# EAGLE design Generator_V0.9 (EAGLE 5.09)

## Sheet 1 of 5
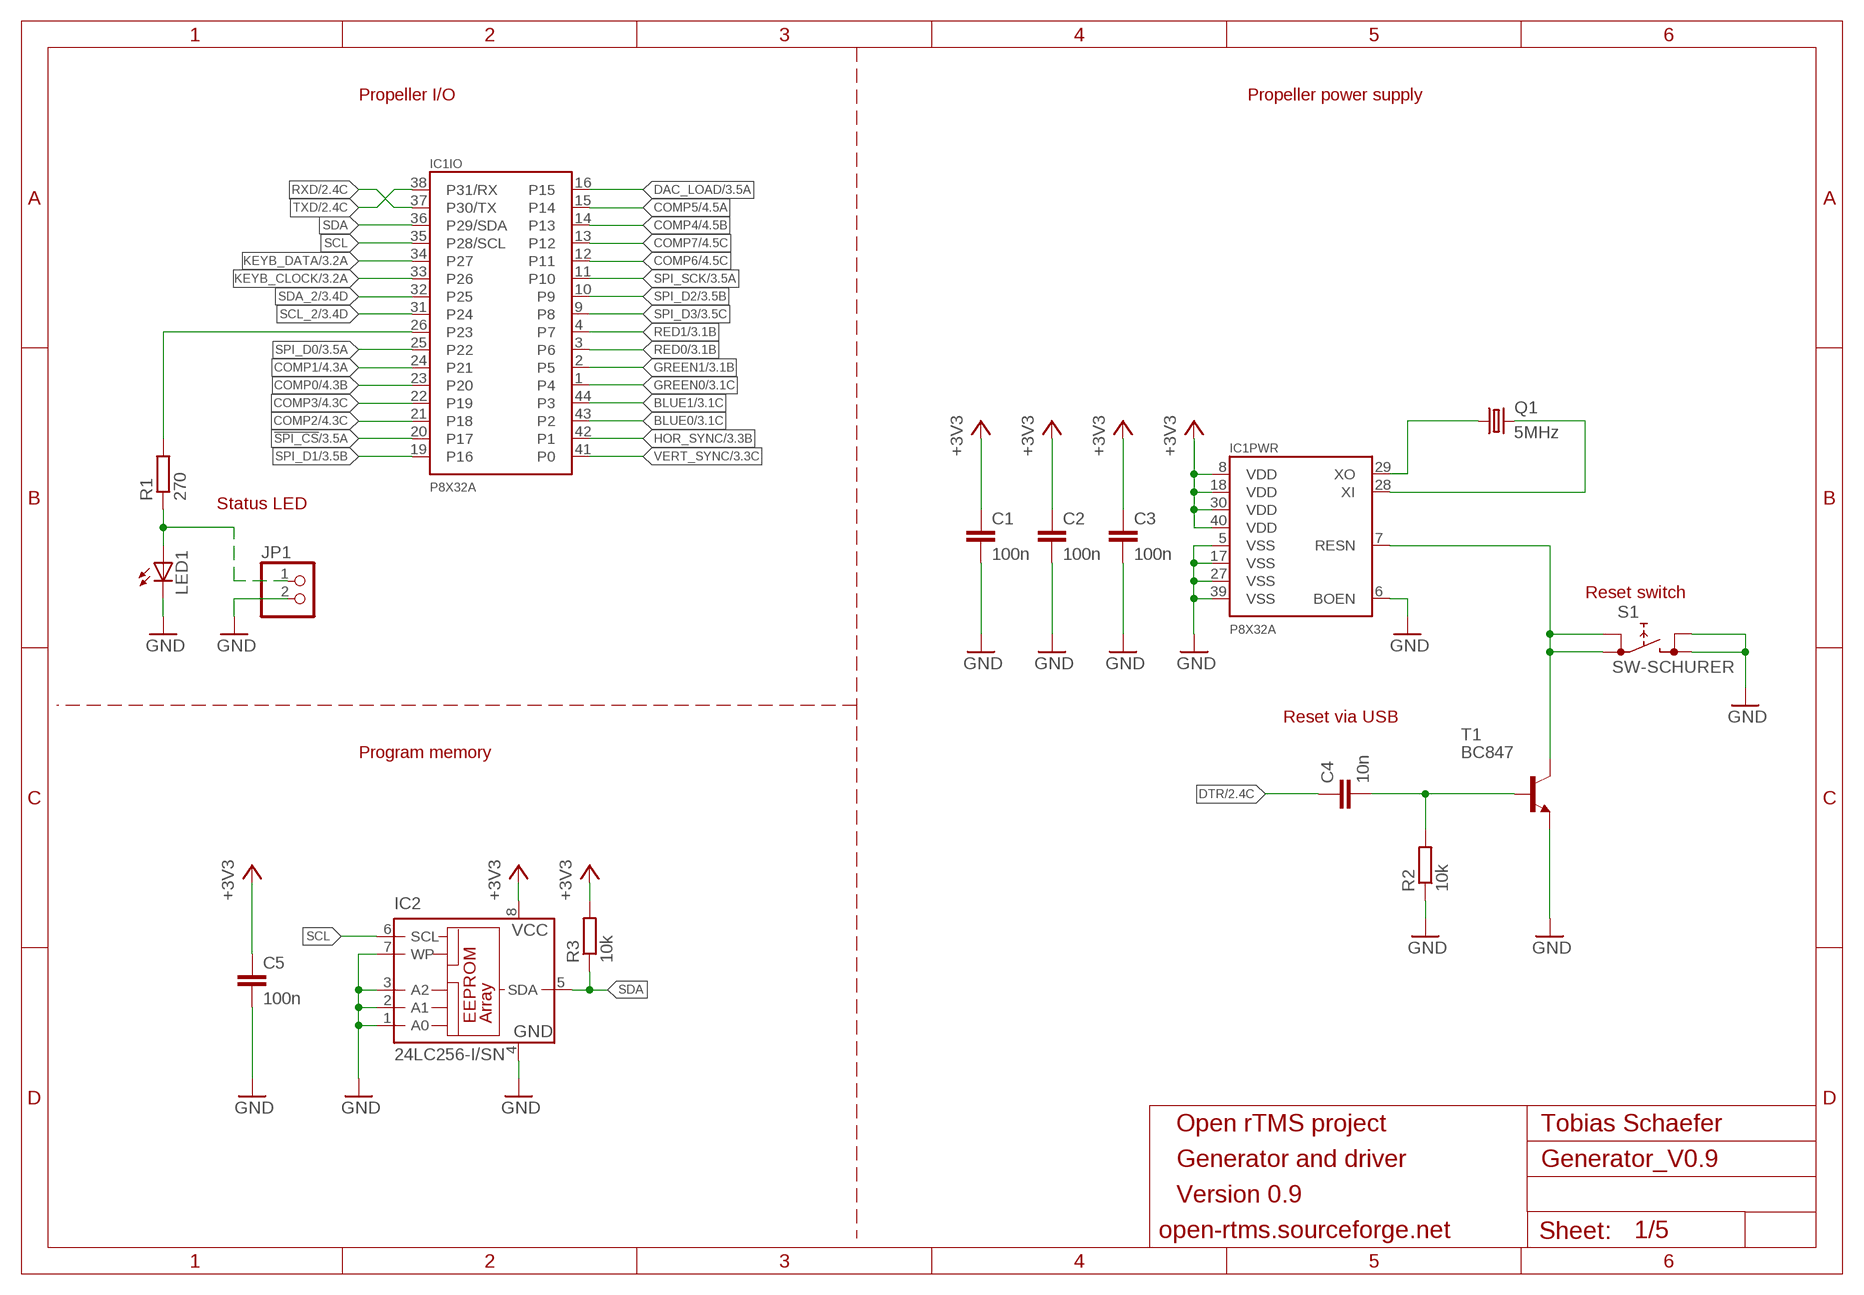
[diagram p0: schematic, sheet 1]

### Parts
C1  100n  C-EUC0603  [C0603]
C2  100n  C-EUC0603  [C0603]
C3  100n  C-EUC0603  [C0603]
C4  10n  C-EUC0603  [C0603]
C5  100n  C-EUC0603  [C0603]
IC1  P8X32A  [VQ44]
IC2  24LC256-I/SN  24C02SN  [SO-08]
JP1  PINHD-1X2  [1X02]
LED1  LEDCHIPLED_0603  [CHIPLED_0603]
Q1  5MHz  CRYSTALCTS406  [CTS406]
R1  270  R-EU_R0603  [R0603]
R2  10k  R-EU_R0603  [R0603]
R3  10k  R-EU_R0603  [R0603]
S1  SW-SCHURER  [SW-SCHUERTER]
T1  BC847  [SOT23]

### Nets
!SPI_CS!: IC1.20(IO:P17) ; also sheet 3
+3V3: C1.1 C2.1 C3.1 C5.1 IC1.8(PWR:VDD) IC1.18(PWR:VDD) IC1.30(PWR:VDD) IC1.40(PWR:VDD) IC2.8(VCC) R3.2 ; also sheet 2,3,4
BLUE0: IC1.43(IO:P2) ; also sheet 3
BLUE1: IC1.44(IO:P3) ; also sheet 3
COMP0: IC1.23(IO:P20) ; also sheet 4
COMP1: IC1.24(IO:P21) ; also sheet 4
COMP2: IC1.21(IO:P18) ; also sheet 4
COMP3: IC1.22(IO:P19) ; also sheet 4
COMP4: IC1.14(IO:P13) ; also sheet 4
COMP5: IC1.15(IO:P14) ; also sheet 4
COMP6: IC1.12(IO:P11) ; also sheet 4
COMP7: IC1.13(IO:P12) ; also sheet 4
DAC_LOAD: IC1.16(IO:P15) ; also sheet 3
DTR: C4.1 ; also sheet 2
GND: C1.2 C2.2 C3.2 C5.2 IC1.5(PWR:VSS) IC1.6(PWR:BOEN) IC1.17(PWR:VSS) IC1.27(PWR:VSS) IC1.39(PWR:VSS) IC2.1(A0) IC2.2(A1) IC2.3(A2) IC2.4(GND) IC2.7(WP) JP1.2 LED1.C R2.1 S1.P$2 S1.P$4 T1.2(E) ; also sheet 2,3,4
GREEN0: IC1.1(IO:P4) ; also sheet 3
GREEN1: IC1.2(IO:P5) ; also sheet 3
HOR_SYNC: IC1.42(IO:P1) ; also sheet 3
KEYB_CLOCK: IC1.33(IO:P26) ; also sheet 3
KEYB_DATA: IC1.34(IO:P27) ; also sheet 3
N$1: IC1.28(PWR:XI) Q1.3
N$2: IC1.29(PWR:XO) Q1.1
N$3: C4.2 R2.2 T1.1(B)
N$4: IC1.7(PWR:RESN) S1.P$1 S1.P$3 T1.3(C)
N$36: IC1.26(IO:P23) R1.2
N$37: JP1.1 LED1.A R1.1
RED0: IC1.3(IO:P6) ; also sheet 3
RED1: IC1.4(IO:P7) ; also sheet 3
RXD: IC1.37(IO:P30/TX) ; also sheet 2
SCL: IC1.35(IO:P28/SCL) IC2.6(SCL)
SCL_2: IC1.31(IO:P24) ; also sheet 3
SDA: IC1.36(IO:P29/SDA) IC2.5(SDA) R3.1
SDA_2: IC1.32(IO:P25) ; also sheet 3
SPI_D0: IC1.25(IO:P22) ; also sheet 3
SPI_D1: IC1.19(IO:P16) ; also sheet 3
SPI_D2: IC1.10(IO:P9) ; also sheet 3
SPI_D3: IC1.9(IO:P8) ; also sheet 3
SPI_SCK: IC1.11(IO:P10) ; also sheet 3
TXD: IC1.38(IO:P31/RX) ; also sheet 2
VERT_SYNC: IC1.41(IO:P0) ; also sheet 3

### Notes on the sheet
- Propeller I/O | Propeller power supply
- Status LED
- Reset switch
- Reset via USB
- Program memory
- Open rTMS project | Tobias Schaefer
- Generator and driver
- Version 0.9
- open-rtms.sourceforge.net

## Sheet 2 of 5
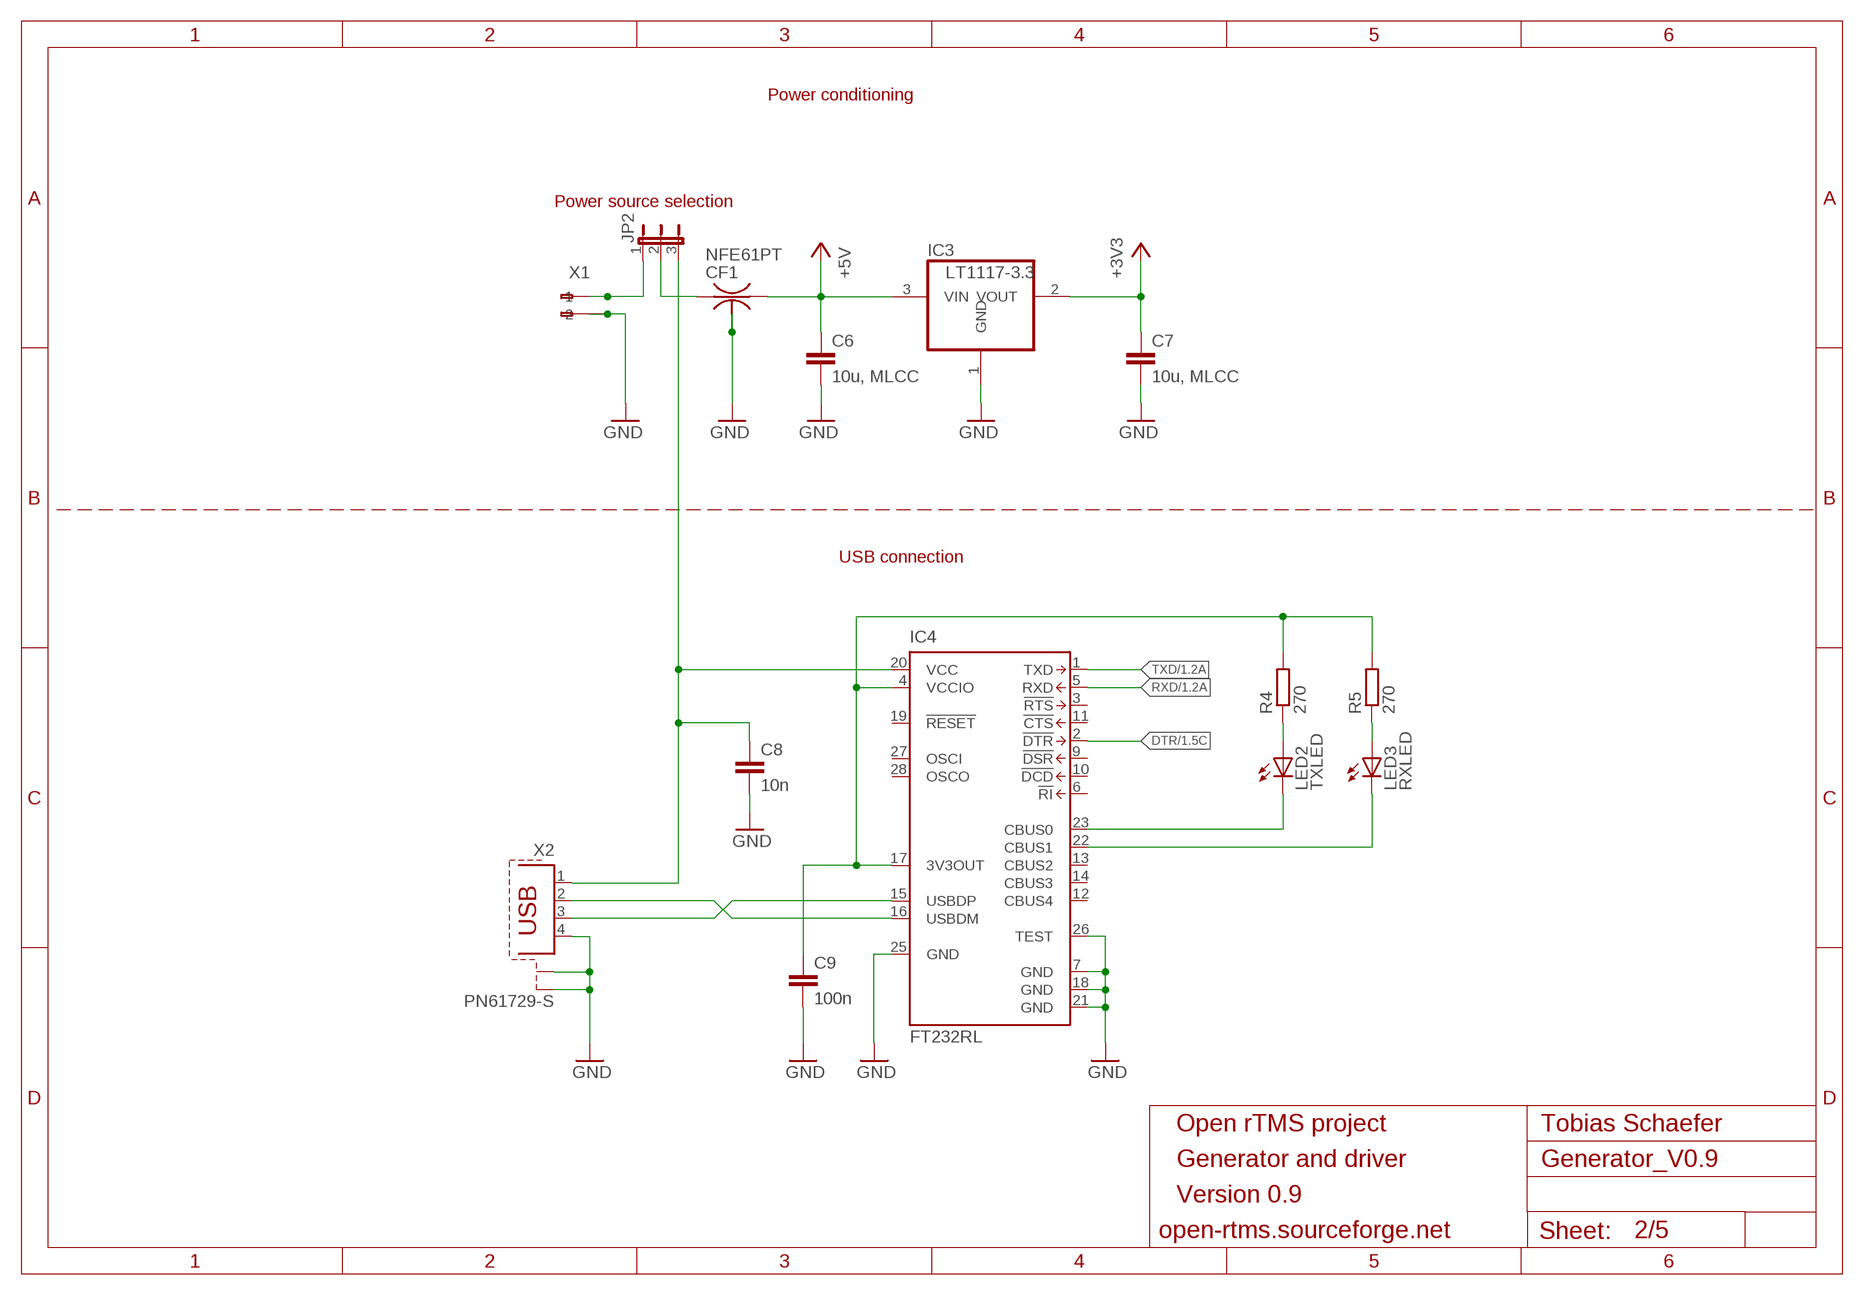
[diagram p1: schematic, sheet 2]

### Parts
C6  10u, MLCC  C-EUC0805  [C0805]
C7  10u, MLCC  C-EUC0805  [C0805]
C8  10n  C-EUC0603  [C0603]
C9  100n  C-EUC0603  [C0603]
CF1  NFE61PT  [NFE61PT]
IC3  LT1117-3.3  REG1117  [SOT223]
IC4  FT232RL  [SSOP28]
JP2  JP2E  [JP2]
LED2  TXLED  LEDCHIPLED_0603  [CHIPLED_0603]
LED3  RXLED  LEDCHIPLED_0603  [CHIPLED_0603]
R4  270  R-EU_R0603  [R0603]
R5  270  R-EU_R0603  [R0603]
X1  233-102  [233-102]
X2  PN61729-S  [PN61729-S]

### Nets
+3V3: C7.1 IC3.2(VOUT) ; also sheet 1,3,4
+5V: C6.1 CF1.3 IC3.3(VIN) ; also sheet 3,4
DTR: IC4.2(!DTR) ; also sheet 1
GND: C6.2 C7.2 C8.2 C9.2 CF1.2@1 CF1.2@2 IC3.1(GND) IC4.7(GND) IC4.18(GND) IC4.21(GND) IC4.25(GND) IC4.26(TEST) X1.A2(-2) X1.B2(B-2) X2.4 X2.S1 X2.S2 ; also sheet 1,3,4
N$5: C9.1 IC4.4(VCCIO) IC4.17(3V3OUT) R4.2 R5.2
N$6: IC4.16(USBDM) X2.2
N$7: IC4.15(USBDP) X2.3
N$8: C8.1 IC4.20(VCC) JP2.3 X2.1
N$12: CF1.1 JP2.2
N$18: LED2.A R4.1
N$19: LED3.A R5.1
N$20: IC4.23(CBUS0) LED2.C
N$21: IC4.22(CBUS1) LED3.C
N$35: JP2.1 X1.A1(-1) X1.B1(B-1)
RXD: IC4.5(RXD) ; also sheet 1
TXD: IC4.1(TXD) ; also sheet 1
Unconnected: IC4.3(!RTS) IC4.6(!RI) IC4.9(!DSR) IC4.10(!DCD) IC4.11(!CTS) IC4.12(CBUS4) IC4.13(CBUS2) IC4.14(CBUS3) IC4.19(!RESET) IC4.27(OSCI) IC4.28(OSCO)

### Notes on the sheet
- Power conditioning
- Power source selection
- USB connection
- Open rTMS project | Tobias Schaefer
- Generator and driver
- Version 0.9
- open-rtms.sourceforge.net

## Sheet 3 of 5
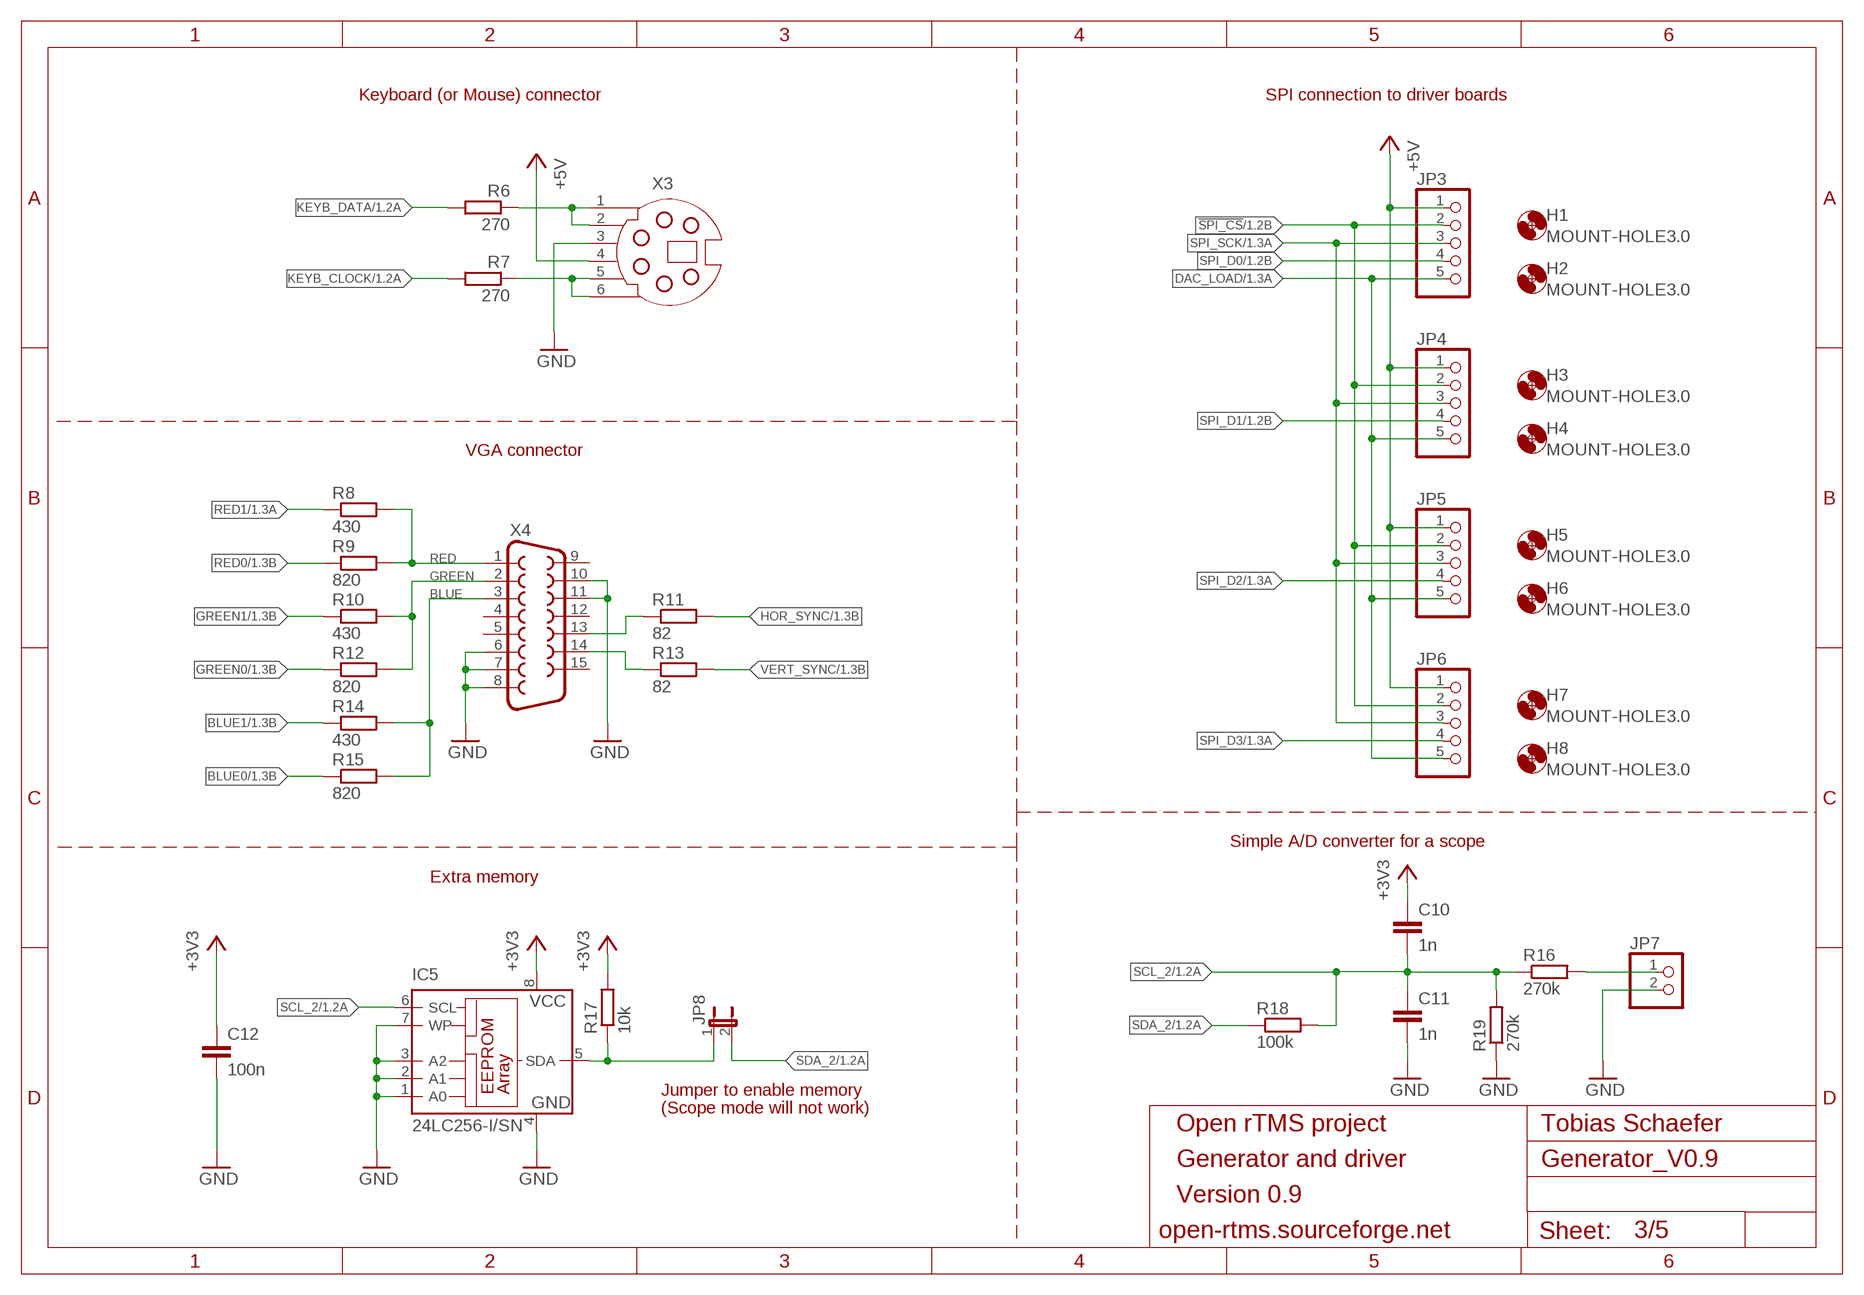
[diagram p2: schematic, sheet 3]

### Parts
C10  1n  C-EUC0603  [C0603]
C11  1n  C-EUC0603  [C0603]
C12  100n  C-EUC0603  [C0603]
H1  MOUNT-HOLE3.0  [3,0]
H2  MOUNT-HOLE3.0  [3,0]
H3  MOUNT-HOLE3.0  [3,0]
H4  MOUNT-HOLE3.0  [3,0]
H5  MOUNT-HOLE3.0  [3,0]
H6  MOUNT-HOLE3.0  [3,0]
H7  MOUNT-HOLE3.0  [3,0]
H8  MOUNT-HOLE3.0  [3,0]
IC5  24LC256-I/SN  24C02SN  [SO-08]
JP3  PINHD-1X5  [1X05]
JP4  PINHD-1X5  [1X05]
JP5  PINHD-1X5  [1X05]
JP6  PINHD-1X5  [1X05]
JP7  PINHD-1X2  [1X02]
JP8  JP1E  [JP1]
R6  270  R-EU_R0603  [R0603]
R7  270  R-EU_R0603  [R0603]
R8  430  R-EU_R0603  [R0603]
R9  820  R-EU_R0603  [R0603]
R10  430  R-EU_R0603  [R0603]
R11  82  R-EU_R0603  [R0603]
R12  820  R-EU_R0603  [R0603]
R13  82  R-EU_R0603  [R0603]
R14  430  R-EU_R0603  [R0603]
R15  820  R-EU_R0603  [R0603]
R16  270k  R-EU_R0603  [R0603]
R17  10k  R-EU_R0603  [R0603]
R18  100k  R-EU_R0603  [R0603]
R19  270k  R-EU_R0603  [R0603]
X3  MDSSV-BC06  [SSV-BC06]
X4  F15HDH  [HDF15H]

### Nets
!SPI_CS!: JP3.2 JP4.2 JP5.2 JP6.2 ; also sheet 1
+3V3: C10.1 C12.1 IC5.8(VCC) R17.2 ; also sheet 1,2,4
+5V: JP3.1 JP4.1 JP5.1 JP6.1 X3.4 ; also sheet 2,4
BLUE: R14.2 R15.2 X4.3
BLUE0: R15.1 ; also sheet 1
BLUE1: R14.1 ; also sheet 1
DAC_LOAD: JP3.5 JP4.5 JP5.5 JP6.5 ; also sheet 1
GND: C11.2 C12.2 IC5.1(A0) IC5.2(A1) IC5.3(A2) IC5.4(GND) IC5.7(WP) JP7.2 R19.1 X3.3 X4.6 X4.7 X4.8 X4.10 X4.11 ; also sheet 1,2,4
GREEN: R10.2 R12.2 X4.2
GREEN0: R12.1 ; also sheet 1
GREEN1: R10.1 ; also sheet 1
HOR_SYNC: R11.2 ; also sheet 1
HSYNC: R11.1 X4.13
KEYB_CLOCK: R7.2 ; also sheet 1
KEYB_DATA: R6.2 ; also sheet 1
N$40: R6.1 X3.1 X3.2
N$42: IC5.5(SDA) JP8.1 R17.1
N$43: JP7.1 R16.2
N$65: R7.1 X3.5 X3.6
RED: R8.2 R9.2 X4.1
RED0: R9.1 ; also sheet 1
RED1: R8.1 ; also sheet 1
SCL_2: C10.2 C11.1 IC5.6(SCL) R16.1 R18.2 R19.2 ; also sheet 1
SDA_2: JP8.2 R18.1 ; also sheet 1
SPI_D0: JP3.4 ; also sheet 1
SPI_D1: JP4.4 ; also sheet 1
SPI_D2: JP5.4 ; also sheet 1
SPI_D3: JP6.4 ; also sheet 1
SPI_SCK: JP3.3 JP4.3 JP5.3 JP6.3 ; also sheet 1
VERT_SYNC: R13.2 ; also sheet 1
VSYNC: R13.1 X4.14
Unconnected: X4.4 X4.5 X4.9 X4.12 X4.15

### Notes on the sheet
- Keyboard (or Mouse) connector | SPI connection to driver boards
- VGA connector
- Simple A/D converter for a scope
- Extra memory
- Jumper to enable memory
- (Scope mode will not work)
- Open rTMS project | Tobias Schaefer
- Generator and driver
- Version 0.9
- open-rtms.sourceforge.net

## Sheet 4 of 5
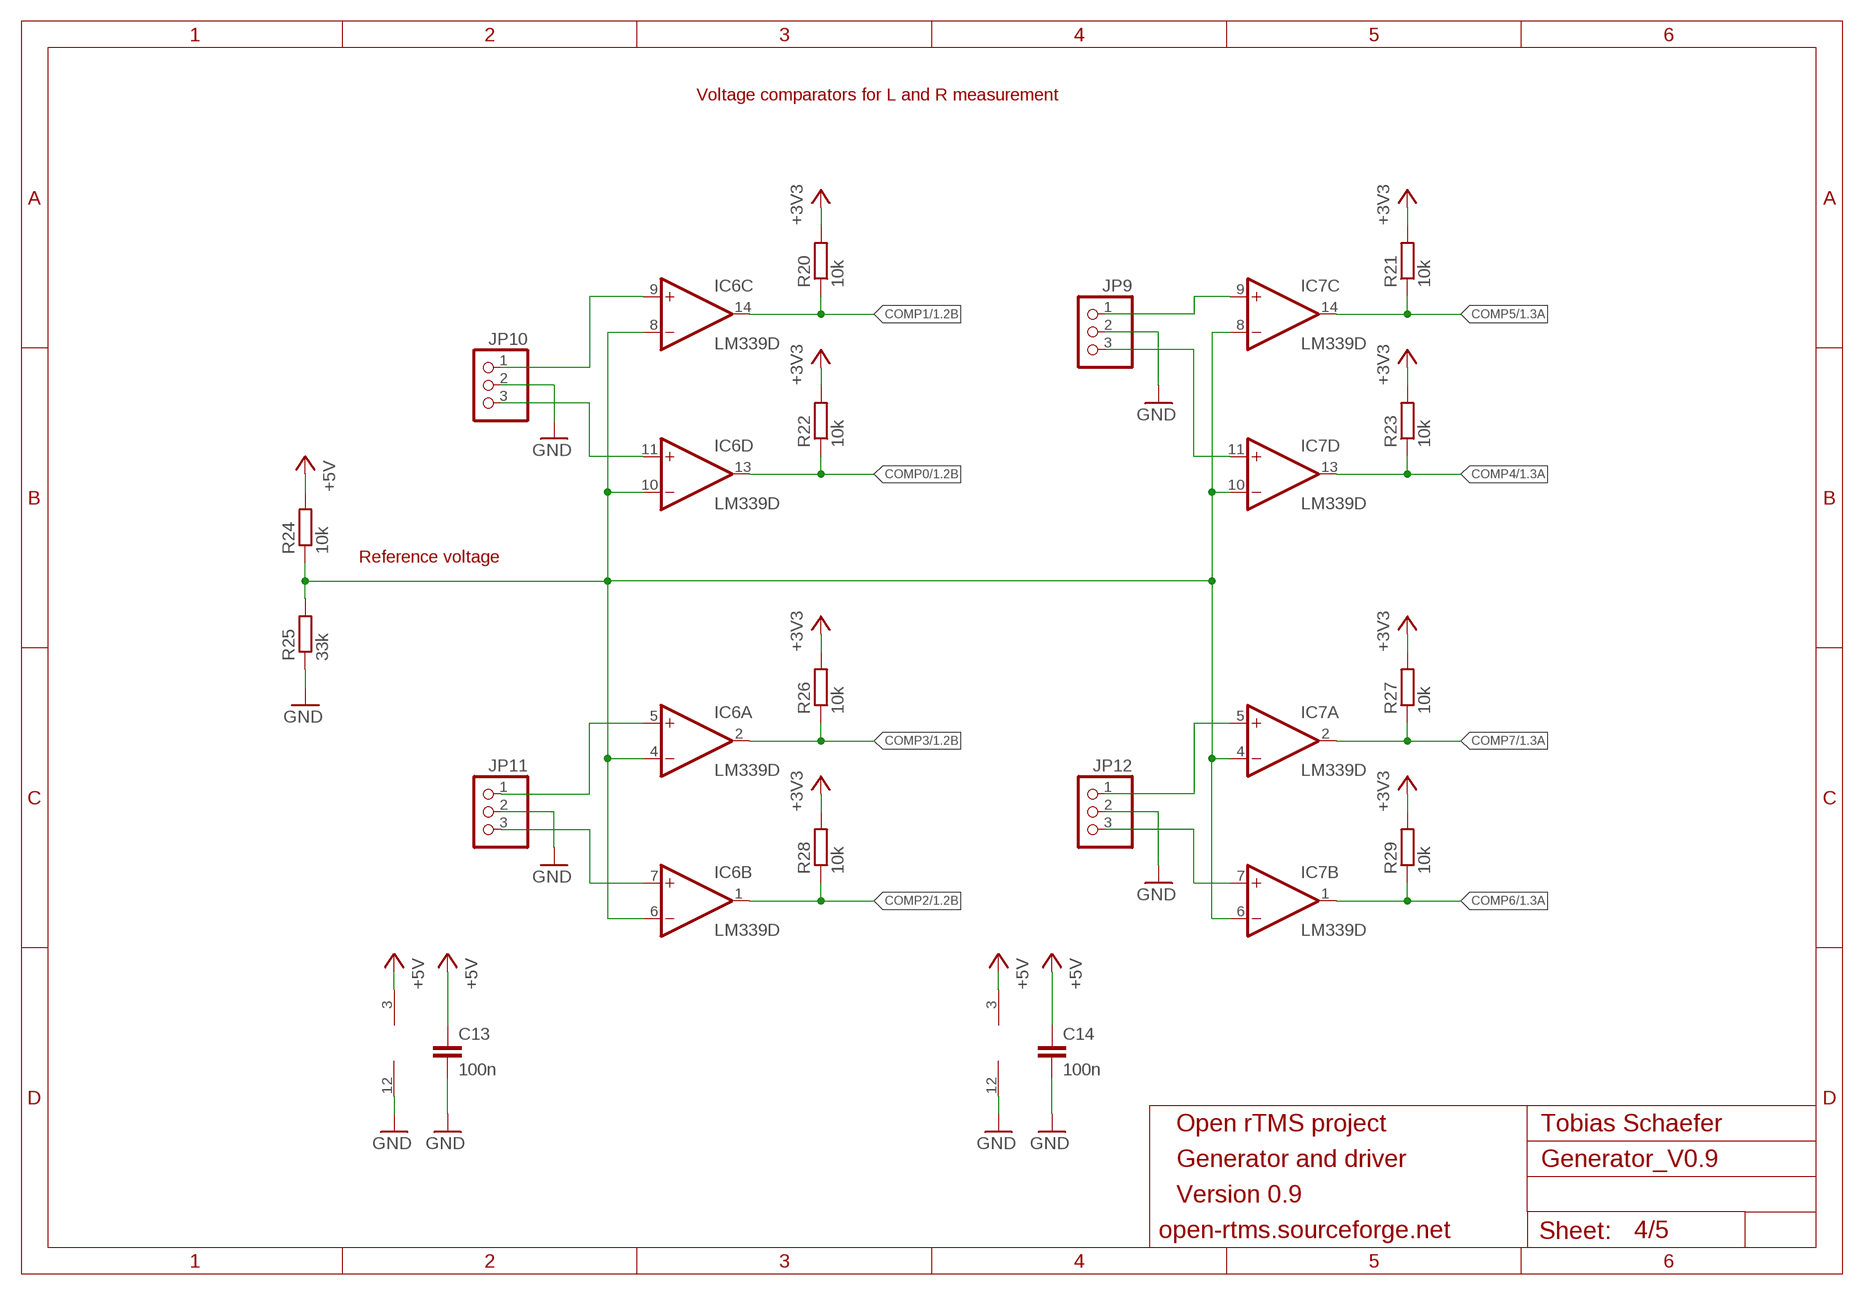
[diagram p3: schematic, sheet 4]

### Parts
C13  100n  C-EUC0603  [C0603]
C14  100n  C-EUC0603  [C0603]
IC6  LM339D  [SO14]
IC7  LM339D  [SO14]
JP9  PINHD-1X3  [1X03]
JP10  PINHD-1X3  [1X03]
JP11  PINHD-1X3  [1X03]
JP12  PINHD-1X3  [1X03]
R20  10k  R-EU_R0603  [R0603]
R21  10k  R-EU_R0603  [R0603]
R22  10k  R-EU_R0603  [R0603]
R23  10k  R-EU_R0603  [R0603]
R24  10k  R-EU_R0603  [R0603]
R25  33k  R-EU_R0603  [R0603]
R26  10k  R-EU_R0603  [R0603]
R27  10k  R-EU_R0603  [R0603]
R28  10k  R-EU_R0603  [R0603]
R29  10k  R-EU_R0603  [R0603]

### Nets
+3V3: R20.2 R21.2 R22.2 R23.2 R26.2 R27.2 R28.2 R29.2 ; also sheet 1,2,3
+5V: C13.1 C14.1 IC6.3(P:V+) IC7.3(P:V+) R24.2 ; also sheet 2,3
COMP0: IC6.13(D:OUT) R22.1 ; also sheet 1
COMP1: IC6.14(C:OUT) R20.1 ; also sheet 1
COMP2: IC6.1(B:OUT) R28.1 ; also sheet 1
COMP3: IC6.2(A:OUT) R26.1 ; also sheet 1
COMP4: IC7.13(D:OUT) R23.1 ; also sheet 1
COMP5: IC7.14(C:OUT) R21.1 ; also sheet 1
COMP6: IC7.1(B:OUT) R29.1 ; also sheet 1
COMP7: IC7.2(A:OUT) R27.1 ; also sheet 1
GND: C13.2 C14.2 IC6.12(P:GND) IC7.12(P:GND) JP9.2 JP10.2 JP11.2 JP12.2 R25.1 ; also sheet 1,2,3
N$34: IC6.5(A:+IN) JP11.1
N$38: IC6.9(C:+IN) JP10.1
N$39: IC6.11(D:+IN) JP10.3
N$41: IC6.7(B:+IN) JP11.3
N$46: IC7.9(C:+IN) JP9.1
N$47: IC7.11(D:+IN) JP9.3
N$48: IC6.4(A:-IN) IC6.6(B:-IN) IC6.8(C:-IN) IC6.10(D:-IN) IC7.4(A:-IN) IC7.6(B:-IN) IC7.8(C:-IN) IC7.10(D:-IN) R24.1 R25.2
N$49: IC7.5(A:+IN) JP12.1
N$50: IC7.7(B:+IN) JP12.3

### Notes on the sheet
- Voltage comparators for L and R measurement
- Reference voltage
- Open rTMS project | Tobias Schaefer
- Generator and driver
- Version 0.9
- open-rtms.sourceforge.net

## Sheet 5 of 5
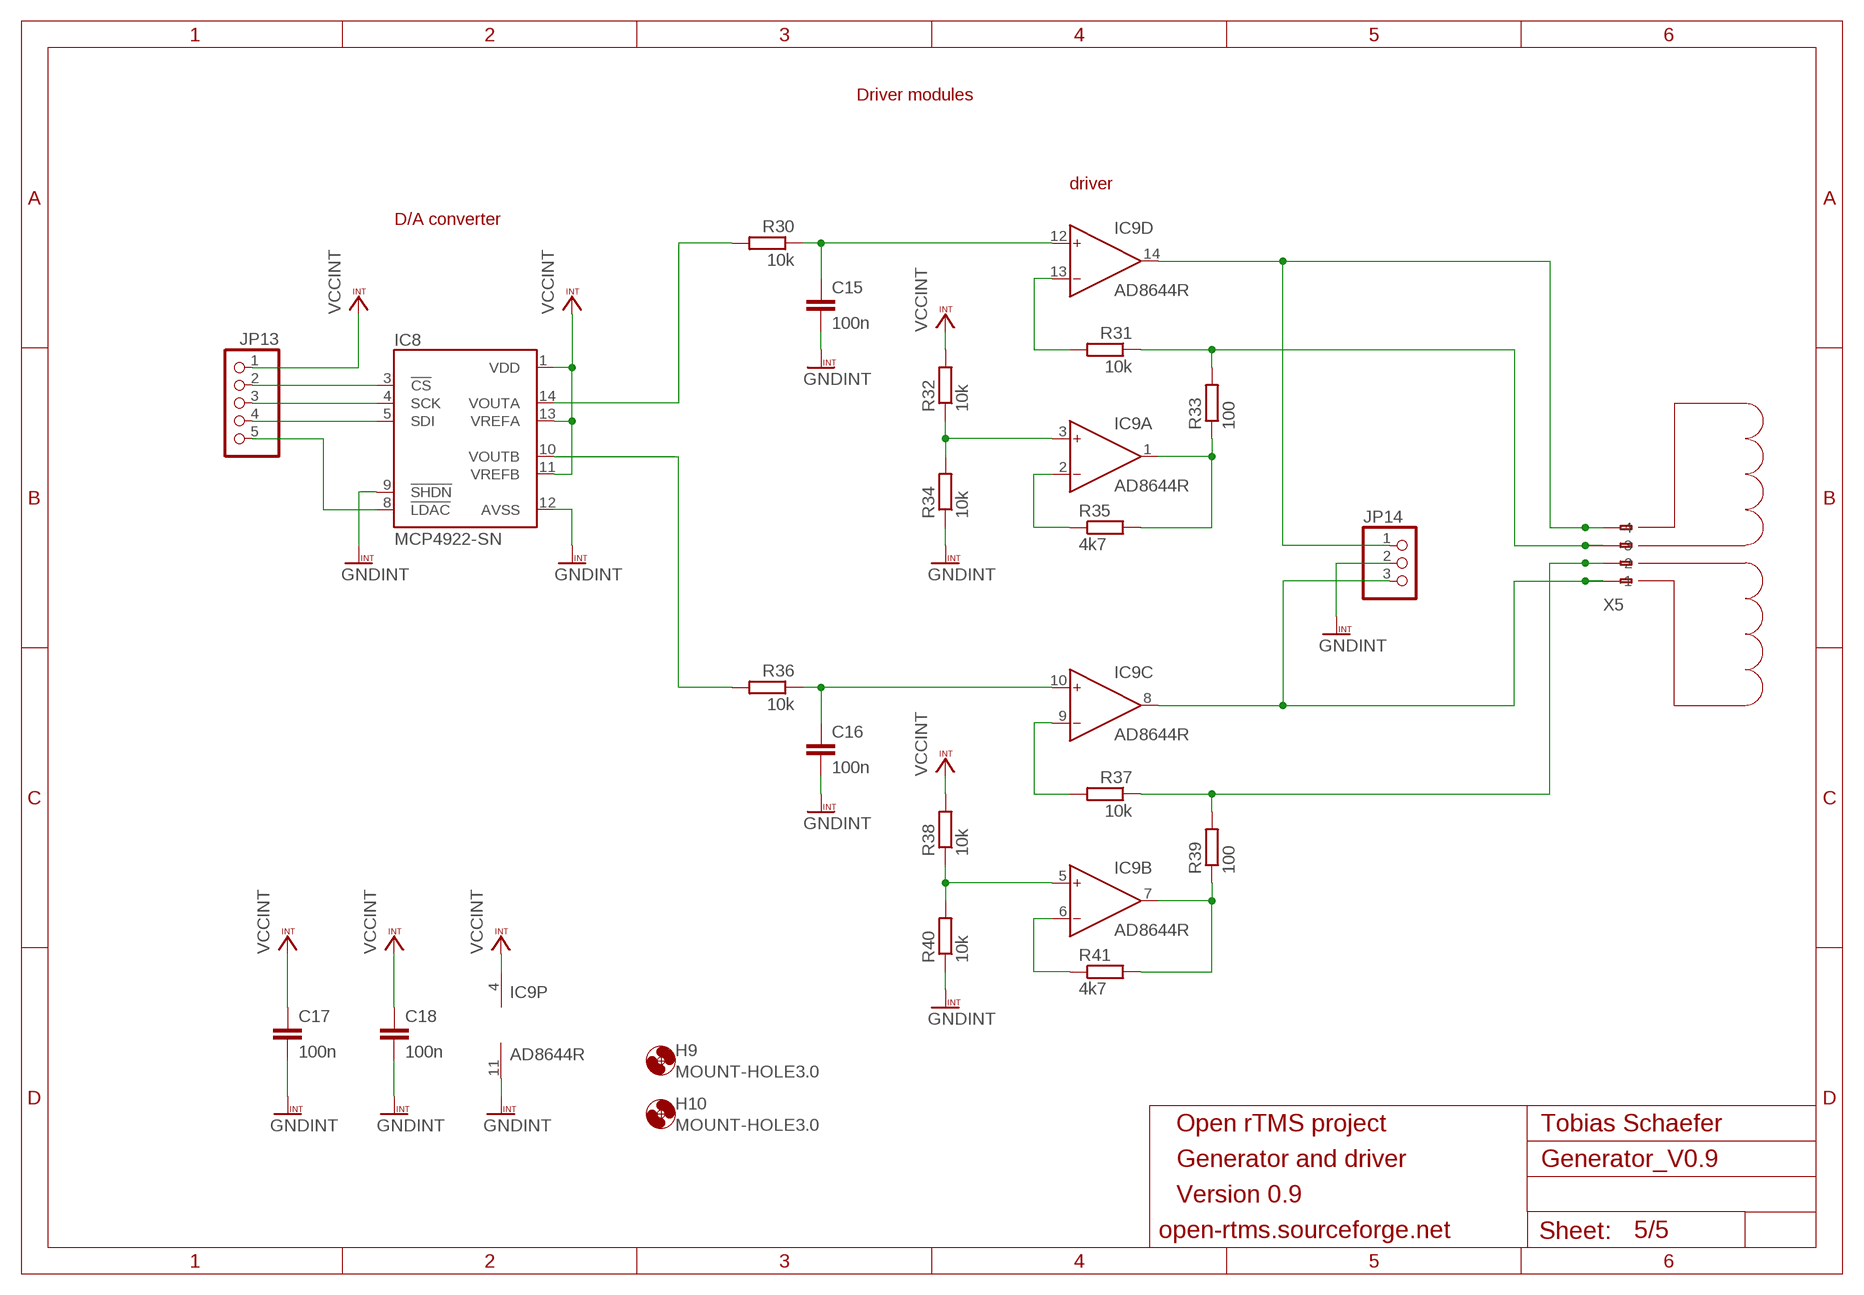
[diagram p4: schematic, sheet 5]

### Parts
C15  100n  C-EUC0603  [C0603]
C16  100n  C-EUC0603  [C0603]
C17  100n  C-EUC0603  [C0603]
C18  100n  C-EUC0603  [C0603]
H9  MOUNT-HOLE3.0  [3,0]
H10  MOUNT-HOLE3.0  [3,0]
IC8  MCP4922-SN  [SO-14]
IC9  AD8644R  [SO14]
JP13  PINHD-1X5  [1X05]
JP14  PINHD-1X3  [1X03]
R30  10k  R-EU_R0603  [R0603]
R31  10k  R-EU_R0603  [R0603]
R32  10k  R-EU_R0603  [R0603]
R33  100  R-EU_R0603  [R0603]
R34  10k  R-EU_R0603  [R0603]
R35  4k7  R-EU_R0603  [R0603]
R36  10k  R-EU_R0603  [R0603]
R37  10k  R-EU_R0603  [R0603]
R38  10k  R-EU_R0603  [R0603]
R39  100  R-EU_R0603  [R0603]
R40  10k  R-EU_R0603  [R0603]
R41  4k7  R-EU_R0603  [R0603]
X5  233-104  [233-104]

### Nets
GNDINT: C15.2 C16.2 C17.2 C18.2 IC8.9(!SHDN!) IC8.12(AVSS) IC9.11(P:V-) JP14.2 R34.1 R40.1
N$9: IC9.3(A:IN+) R32.1 R34.2
N$10: IC9.2(A:IN-) R35.1
N$11: IC9.1(A:OUT) R33.1 R35.2
N$13: IC9.14(D:OUT) JP14.1 X5.A4(-4) X5.B4(B-4)
N$14: C15.1 IC9.12(D:IN+) R30.1
N$15: IC8.14(VOUTA) R30.2
N$16: IC8.10(VOUTB) R36.2
N$17: IC9.13(D:IN-) R31.2
N$22: IC8.3(!CS!) JP13.2
N$23: IC9.5(B:IN+) R38.1 R40.2
N$24: IC9.6(B:IN-) R41.1
N$25: IC9.7(B:OUT) R39.1 R41.2
N$26: IC9.8(C:OUT) JP14.3 X5.A1(-1) X5.B1(B-1)
N$27: C16.1 IC9.10(C:IN+) R36.1
N$28: IC8.4(SCK) JP13.3
N$29: IC9.9(C:IN-) R37.2
N$30: R37.1 R39.2 X5.A2(-2) X5.B2(B-2)
N$31: IC8.5(SDI) JP13.4
N$32: IC8.8(!LDAC!) JP13.5
N$33: R31.1 R33.2 X5.A3(-3) X5.B3(B-3)
VCCINT: C17.1 C18.1 IC8.1(VDD) IC8.11(VREFB) IC8.13(VREFA) IC9.4(P:V+) JP13.1 R32.2 R38.2

### Notes on the sheet
- Driver modules
- driver
- D/A converter
- Open rTMS project | Tobias Schaefer
- Generator and driver
- Version 0.9
- open-rtms.sourceforge.net

## Library data of the parts
C1-C18 = rcl:C-EU: CAPACITOR, European symbol
CF1 = iei_tobyparts:NFE: Entstörfilter Typ NFE 61PT CMS, 2A NFE muRata
H1-H10 = holes:MOUNT-HOLE: MOUNTING HOLE with drill center marker
IC1 = iei_tobyparts:P8X32A: Parallax Propeller Specifications Model P8X32A Power Requirements 3.3 volts DC. (Max current draw must be limited to 300 mA). External Clock Speed DC to 80 MHz (4 MHz to 8 MHz with Clock PLL running) System Clock Speed DC to 80 MHz Internal RC Oscillator 12 MHz or 20 kHz (approximate; may range from 8 MHz ? 20 MHz, or 13 kHz ? 33 kHz, respectively) Main RAM/ROM 64 K bytes; 32 KB RAM + 32 KB ROM Cog RAM 512 x 32 bits each RAM/ROM Organization Long (32-bit), Word (16-bit), or Byte (8-bit) addressable I/O pins 32 CMOS signals with VDD/2 input threshold. Current Source/Sink per I/O 40 mA Current Draw @ 3.3 vdc, 70 °F 500 ?A per MIPS (MIPS = Freq in MHz / 4 * Number of Active Cogs)
IC2 IC5 = microchip:24C*: Serial EEPROM 1 K/2 K/4 K
IC3 = burr-brown:REG1117: 800mA and 1A Low Dropout (LDO) Positive Regulator 1.8V, 2.5V, 2.85V, 3.3V, 5V, and Adj
IC4 = ftdichip:FT232R: Source: http://www.ftdichip.com/Documents/DataSheets/DS_FT232R_v104.pdf
IC6 IC7 = linear:LM339: Low Power Low Offset Voltage Quad Comparators with open collector; LM139/LM239/LM339/LM2901/LM3302
IC8 = iei_tobyparts:MCP4922: 12-Bit DAC with SPI Interface MCP4922 Features 12-Bit Resolution ±0.2 LSB DNL (typ) ±2 LSB INL (typ) Dual Channel Rail-to-Rail Output SPI Interface with 20 MHz Clock Support Simultaneous Latching of the Dual DACs w/LDAC Fast Settling Time of 4.5 us Selectable Unity or 2x Gain Output 450 kHz Multiplier Mode External VREF Input 2.7V to 5.5V Single-Supply Operation Extended Temperature Range: -40°C to +125°C
IC9 = analog-devices:AD8644: Single and Quad 18 V Operational Amplifiers Source: http://www.analog.com/static/imported-files/data_sheets/AD8614_8644.pdf
JP1 JP7 = pinhead:PINHD-1X2: PIN HEADER
JP2 = jumper:JP2E: JUMPER
JP3-JP6 JP13 = pinhead:PINHD-1X5: PIN HEADER
JP8 = jumper:JP1E: JUMPER
JP9-JP12 JP14 = pinhead:PINHD-1X3: PIN HEADER
LED1-LED3 = led:LED: LED OSRAM: - CHIPLED LG R971, LG N971, LY N971, LG Q971, LY Q971, LO R971, LY R971 LH N974, LH R974 LS Q976, LO Q976, LY Q976 LO Q996 - Hyper CHIPLED LW Q18S LB Q993, LB Q99A, LB R99A - SideLED LS A670, LO A670, LY A670, LG A670, LP A670 LB A673, LV A673, LT A673, LW A673 LH A674 LY A675 LS A676, LA A676, LO A676, LY A676, LW A676 LS A679, LY A679, LG A679 - Hyper Micro SIDELED® LS Y876, LA Y876, LO Y876, LY Y876 LT Y87S - SmartLED LW L88C, LW L88S LB L89C, LB L89S, LG L890 LS L89K, LO L89K, LY L89K LS L896, LA L896, LO L896, LY L896 - TOPLED LS T670, LO T670, LY T670, LG T670, LP T670 LSG T670, LSP T670, LSY T670, LOP T670, LYG T670 LG T671, LOG T671, LSG T671 LB T673, LV T673, LT T673, LW T673 LH T674 LS T676, LA T676, LO T676, LY T676, LB T676, LH T676, LSB T676, LW T676 LB T67C, LV T67C, LT T67C, LS T67K, LO T67K, LY T67K, LW E67C LS E67B, LA E67B, LO E67B, LY E67B, LB E67C, LV E67C, LT E67C LW T67C LS T679, LY T679, LG T679 LS T770, LO T770, LY T770, LG T770, LP T770 LB T773, LV T773, LT T773, LW T773 LH T774 LS E675, LA E675, LY E675, LS T675 LS T776, LA T776, LO T776, LY T776, LB T776 LHGB T686 LT T68C, LB T68C - Hyper Mini TOPLED® LB M676 - Mini TOPLED Santana® LG M470 LS M47K, LO M47K, LY M47K Source: http://www.osram.convergy.de LUXEON: - LUMILED® LXK2-PW12-R00, LXK2-PW12-S00, LXK2-PW14-U00, LXK2-PW14-V00 LXK2-PM12-R00, LXK2-PM12-S00, LXK2-PM14-U00 LXK2-PE12-Q00, LXK2-PE12-R00, LXK2-PE12-S00, LXK2-PE14-T00, LXK2-PE14-U00 LXK2-PB12-K00, LXK2-PB12-L00, LXK2-PB12-M00, LXK2-PB14-N00, LXK2-PB14-P00, LXK2-PB14-Q00 LXK2-PR12-L00, LXK2-PR12-M00, LXK2-PR14-Q00, LXK2-PR14-R00 LXK2-PD12-Q00, LXK2-PD12-R00, LXK2-PD12-S00 LXK2-PH12-R00, LXK2-PH12-S00 LXK2-PL12-P00, LXK2-PL12-Q00, LXK2-PL12-R00 Source: www.luxeon.com KINGBRIGHT: KA-3528ASYC Source: www.kingbright.com
Q1 = crystal:CRYSTAL: CRYSTAL
R1-R41 = rcl:R-EU_: RESISTOR, European symbol
S1 = iei_tobyparts:SW-SCHURER
T1 = transistor:BC847: NPN TRANSISTOR
X1 = con-wago255:233-102: WAGO
X2 = con-berg:PN61729-S: BERG USB connector
X3 = con-yamaichi:MDSSV-BC06: YAMAICHI CONNECTOR
X4 = con-subd:F15: SUB-D
X5 = con-wago255:233-104: WAGO

## Board
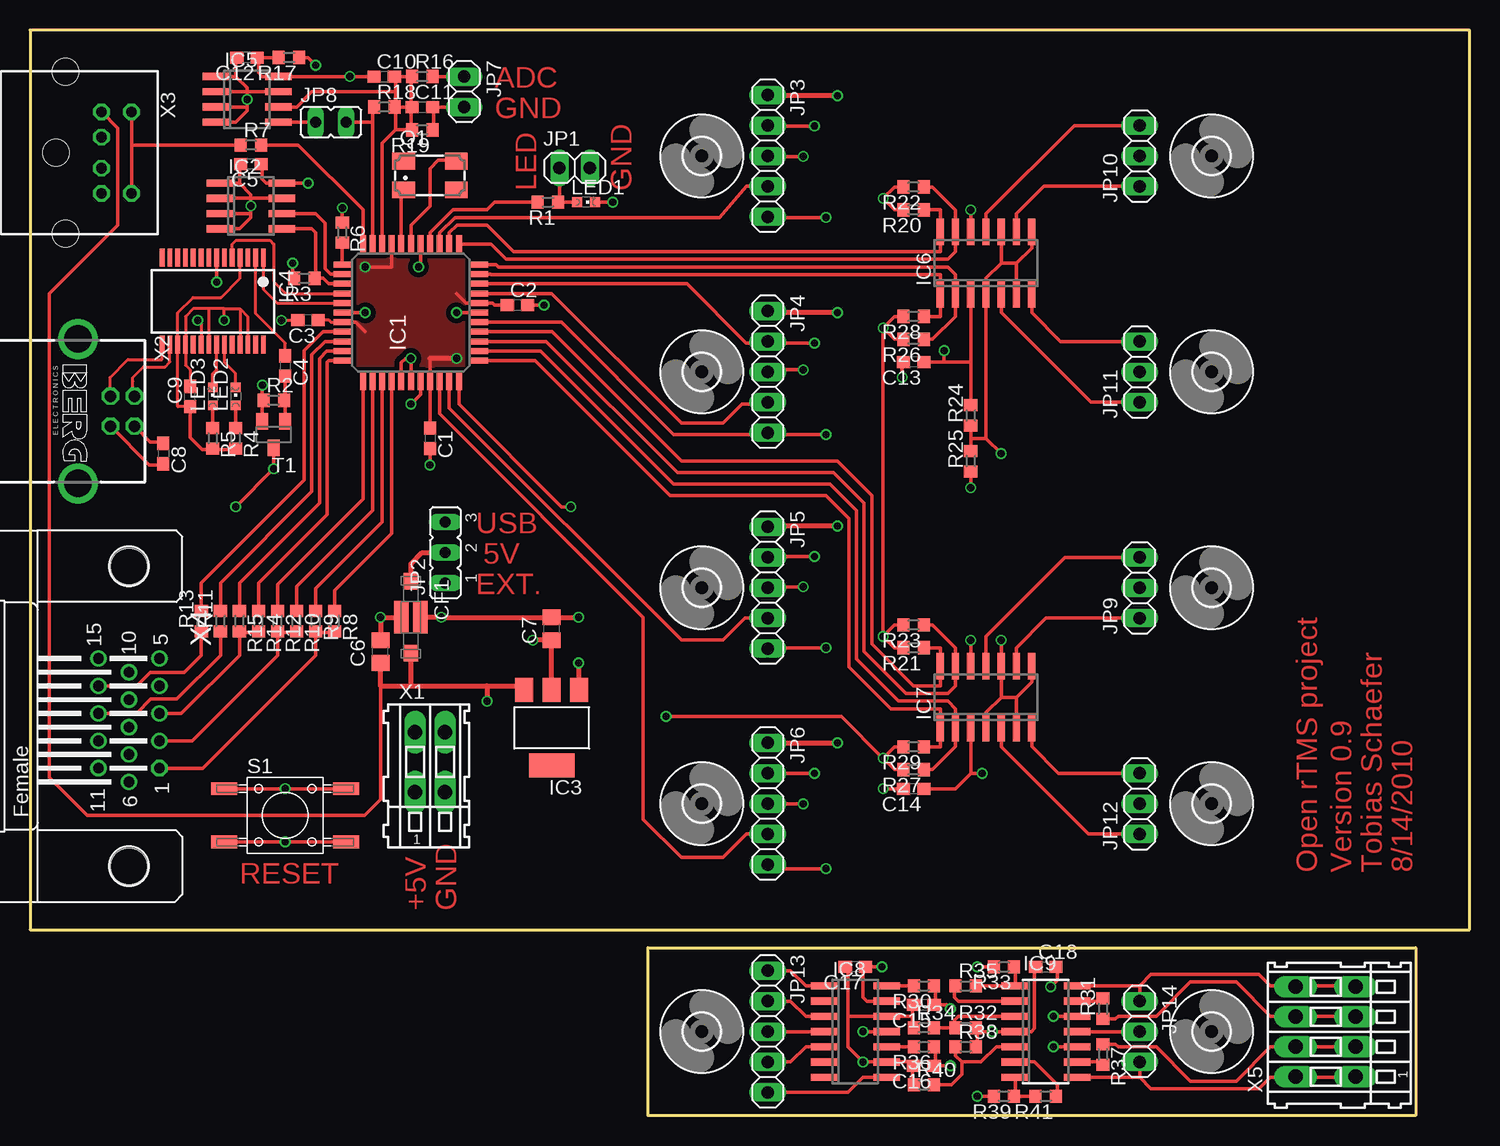
[diagram p5: board, top side]
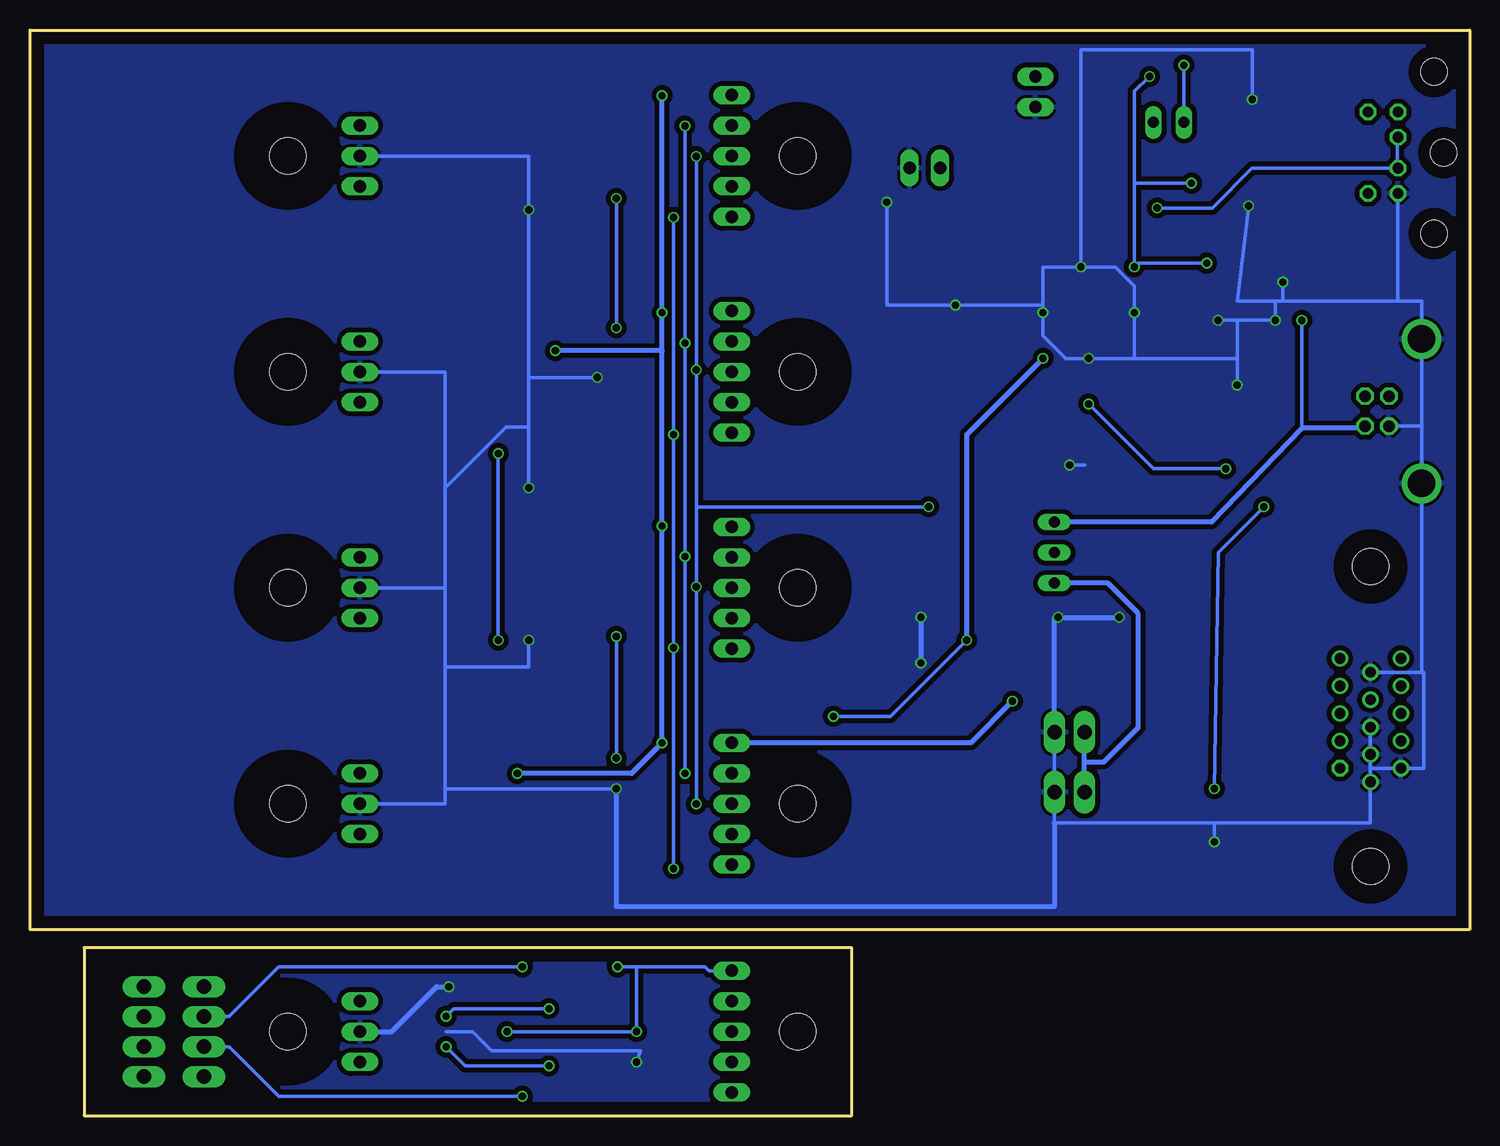
[diagram p6: board, bottom side, seen from below]

Size 120 x 90.5 mm. Coordinates in mm from the lower left corner, seen from the top.
Outline: 120,90.5 0,90.5 0,15.5 120,15.5 120,90.5
Outline: 51.5,0 51.5,14 115.5,14 115.5,0 51.5,0
Copper layers (1*16): Top 0.035mm / dielectric 1.5mm / Bottom 0.035mm
Design rules "fischer *": minimum track width 11mil, minimum drill 0.3mm, track to track 0.15mm, track to pad 0.15mm, pad to pad 0.15mm, via to via 0.15mm, smd to smd 0.15mm, copper to edge 40mil, drill to drill 8mil, minimum pad ring 0.2mm, minimum via ring 0.15mm, stop-mask expansion 0.15mm, vias tented up to drill 0mil, thermal gap 10mil

### Footprints (pad centres in the part's own frame; a part is rotated, then mirrored left to right if it is on the bottom)
C0603 = smd 1.1 x 1: 1 -0.85,0; 2 0.85,0
C0805 = smd 1.3 x 1.5: 1 -0.95,0; 2 0.95,0
NFE61PT = smd 1.4 x 1.2: 1 -3,0; 3 3,0 | smd 2.7 x 1.2: 2@1 0,-0.8; 2@2 0,0.8
3,0 = hole 3: 0,0
VQ44 = smd 1.5 x 0.5: 1 -5.7,4; 2 -5.7,3.2; 3 -5.7,2.4; 4 -5.7,1.6; 5 -5.7,0.8; 6 -5.7,0; 7 -5.7,-0.8; 8 -5.7,-1.6; 9 -5.7,-2.4; 10 -5.7,-3.2; 11 -5.7,-4; 23 5.7,-4; 24 5.7,-3.2; 25 5.7,-2.4; 26 5.7,-1.6; 27 5.7,-0.8; 28 5.7,0; 29 5.7,0.8; 30 5.7,1.6; 31 5.7,2.4; 32 5.7,3.2; 33 5.7,4 | smd 0.5 x 1.5: 12 -4,-5.7; 13 -3.2,-5.7; 14 -2.4,-5.7; 15 -1.6,-5.7; 16 -0.8,-5.7; 17 0,-5.7; 18 0.8,-5.7; 19 1.6,-5.7; 20 2.4,-5.7; 21 3.2,-5.7; 22 4,-5.7; 34 4,5.7; 35 3.2,5.7; 36 2.4,5.7; 37 1.6,5.7; 38 0.8,5.7; 39 0,5.7; 40 -0.8,5.7; 41 -1.6,5.7; 42 -2.4,5.7; 43 -3.2,5.7; 44 -4,5.7
SO-08 = smd 0.6 x 2.2: 1 -1.905,-2.6; 2 -0.635,-2.6; 3 0.635,-2.6; 4 1.905,-2.6; 5 1.905,2.6; 6 0.635,2.6; 7 -0.635,2.6; 8 -1.905,2.6
SOT223 = smd 1.499 x 2.007: 1 -2.261,-3.15; 2 0.025,-3.15; 3 2.311,-3.15 | smd 3.81 x 2.007: 4 0,3.15
SSOP28 = smd 0.4 x 1.5: 1 -4.225,-3.625; 2 -3.575,-3.625; 3 -2.925,-3.625; 4 -2.275,-3.625; 5 -1.625,-3.625; 6 -0.975,-3.625; 7 -0.325,-3.625; 8 0.325,-3.625; 9 0.975,-3.625; 10 1.625,-3.625; 11 2.275,-3.625; 12 2.925,-3.625; 13 3.575,-3.625; 14 4.225,-3.625; 15 4.225,3.625; 16 3.575,3.625; 17 2.925,3.625; 18 2.275,3.625; 19 1.625,3.625; 20 0.975,3.625; 21 0.325,3.625; 22 -0.325,3.625; 23 -0.975,3.625; 24 -1.625,3.625; 25 -2.275,3.625; 26 -2.925,3.625; 27 -3.575,3.625; 28 -4.225,3.625
SO14 = smd 0.6 x 2.2: 1 -3.81,-2.6; 2 -2.54,-2.6; 3 -1.27,-2.6; 4 0,-2.6; 5 1.27,-2.6; 6 2.54,-2.6; 7 3.81,-2.6; 8 3.81,2.6; 9 2.54,2.6; 10 1.27,2.6; 11 0,2.6; 12 -1.27,2.6; 13 -2.54,2.6; 14 -3.81,2.6
SO-14 = smd 0.6 x 2.2: 1 -3.81,-2.6; 2 -2.54,-2.6; 3 -1.27,-2.6; 4 0,-2.6; 5 1.27,-2.6; 6 2.54,-2.6; 7 3.81,-2.6; 8 3.81,2.6; 9 2.54,2.6; 10 1.27,2.6; 11 0,2.6; 12 -1.27,2.6; 13 -2.54,2.6; 14 -3.81,2.6
1X02 = drill 1.016 long: 1 -1.27,0; 2 1.27,0
JP2 = drill 0.914 long: 1 -2.54,0; 2 0,0; 3 2.54,0
1X05 = drill 1.016 long: 1 -5.08,0; 2 -2.54,0; 3 0,0; 4 2.54,0; 5 5.08,0
JP1 = drill 0.914 long: 1 0,-1.27; 2 0,1.27
1X03 = drill 1.016 long: 1 -2.54,0; 2 0,0; 3 2.54,0
CHIPLED_0603 = smd 0.8 x 0.8: A 0,-0.75; C 0,0.75
CTS406 = smd 1.9 x 1.4: 1 -2.2,-1.2; 2 2.2,-1.2; 3 2.2,1.2; 4 -2.2,1.2
R0603 = smd 1 x 1.1: 1 -0.85,0; 2 0.85,0
SW-SCHUERTER = smd 2.184 x 1.067: P$1 -5.08,2.223; P$2 -5.08,-2.223; P$3 5.08,2.223; P$4 5.08,-2.223
SOT23 = smd 1 x 1.4: 1 -0.95,-1.1; 2 0.95,-1.1; 3 0,1.1
233-102 = drill 1.2 long: A1 -1.25,2.5; A2 1.25,2.5; B1 -1.25,-2.5; B2 1.25,-2.5
PN61729-S = drill 0.95 octagon: 1 1.25,4.71; 2 -1.25,4.71; 3 -1.25,2.71; 4 1.25,2.71 | drill 2.3 pad 2.9 round: S1 -6.02,0; S2 6.02,0
SSV-BC06 = drill 0.9 octagon: 1 1.3,8.5; 2 -1.3,8.5; 3 3.4,8.5; 4 -3.4,8.5; 5 3.4,11; 6 -3.4,11 | hole 2.2: -6.75,5.5; 0,4.7; 6.75,5.5
HDF15H = drill 0.9 octagon: 1 4.329,2.54 | drill 0.9 round: 2 2.043,2.54; 3 -0.243,2.54; 4 -2.529,2.54; 5 -4.815,2.54; 6 5.472,0; 7 3.186,0; 8 0.9,0; 9 -1.386,0; 10 -3.672,0; 11 4.329,-2.54; 12 2.043,-2.54; 13 -0.243,-2.54; 14 -2.529,-2.54; 15 -4.815,-2.54 | hole 3: -12.5,0; 12.5,0
233-104 = drill 1.2 long: A1 -3.75,2.5; A2 -1.25,2.5; A3 1.25,2.5; A4 3.75,2.5; B1 -3.75,-2.5; B2 -1.25,-2.5; B3 1.25,-2.5; B4 3.75,-2.5

### Placement (x,y rotation side)
C1  33.34,56.46 270 top
C2  40.64,67.57 0 top
C3  23.18,66.3 180 top
C4  21.27,62.49 270 top
C5  18.41,79.32 180 top
C6  29.21,38.68 90 top
C7  43.5,40.58 90 top
C8  11.11,55.19 270 top
C9  13.34,59.95 90 top
C10  29.53,86.62 0 top
C11  32.7,84.08 0 top
C12  18.1,88.21 180 top
C13  73.66,62.81 180 top
C14  73.66,27.25 180 top
C15  74.52,9.22 180 top
C16  74.52,4.14 180 top
C17  68.8,12.4 180 top
C18  84.68,12.4 0 top
CF1  31.75,41.53 270 top
H1  98.5,80 0 top
H2  56,80 0 top
H3  56,62 0 top
H4  98.5,62 0 top
H5  56,44 0 top
H6  98.5,44 0 top
H7  98.5,26 0 top
H8  56,26 0 top
H9  56,7 0 top
H10  98.5,7 0 top
IC1  31.75,66.94 90 top
IC2  18.41,75.83 270 top
IC3  43.5,32.33 180 top
IC4  15.24,67.89 180 top
IC5  18.1,84.72 270 top
IC6  79.69,71.06 0 top
IC7  79.69,34.87 0 top
IC8  68.8,7 270 top
IC9  84.68,7 270 top
JP1  45.4,79 0 top
JP2  34.61,46.93 90 top
JP3  61.5,80 270 top
JP4  61.5,62 270 top
JP5  61.5,44 270 top
JP6  61.5,26 270 top
JP7  36.2,85.35 270 top
JP8  25.08,82.81 270 top
JP9  92.5,44 90 top
JP10  92.5,80 90 top
JP11  92.5,62 90 top
JP12  92.5,26 90 top
JP13  61.5,7 270 top
JP14  92.5,7 270 top
LED1  46.35,76.14 270 top
LED2  17.14,59.95 0 top
LED3  15.24,59.95 0 top
Q1  33.34,78.37 0 top
R1  43.18,76.14 180 top
R2  20.32,59.63 0 top
R3  22.86,69.79 180 top
R4  17.14,56.46 270 top
R5  15.24,56.46 270 top
R6  26.04,73.6 270 top
R7  18.41,80.91 0 top
R8  25.4,41.22 270 top
R9  23.81,41.22 270 top
R10  22.23,41.22 270 top
R11  15.88,41.22 90 top
R12  20.64,41.22 270 top
R13  14.29,41.22 90 top
R14  19.05,41.22 270 top
R15  17.46,41.22 270 top
R16  32.7,86.62 0 top
R17  21.59,88.21 180 top
R18  29.53,84.08 0 top
R19  32.7,82.17 180 top
R20  73.66,75.51 180 top
R21  73.66,39 180 top
R22  73.66,77.41 180 top
R23  73.66,40.9 180 top
R24  78.42,58.36 90 top
R25  78.42,54.55 90 top
R26  73.66,64.71 180 top
R27  73.66,28.84 180 top
R28  73.66,66.62 180 top
R29  73.66,30.74 180 top
R30  74.52,10.81 180 top
R31  89.44,8.91 90 top
R32  78.01,7.32 0 top
R33  81.19,12.4 180 top
R34  74.52,7.32 0 top
R35  78.01,10.81 0 top
R36  74.52,5.73 180 top
R37  89.44,5.1 270 top
R38  78.01,5.73 0 top
R39  81.19,1.6 180 top
R40  74.52,2.55 0 top
R41  84.68,1.6 180 top
S1  21.27,25.02 0 top
T1  20.32,56.77 180 top
X1  33.34,29.47 0 top
X2  4,58.72 270 top
X3  -2.54,80.27 270 top
X4  8.26,33.28 270 top
X5  108,7 90 top

### Tracks (layer width: path | path; a pad name or v marks a point on that pad's centre or on a via)
!SPI_CS!  (via drill 0.6)
  Top 0.305: JP6.2 61.5,28.52 v65.41,28.52 | JP3.2 61.5,82.49 v65.41,82.49 | v65.41,64.4 61.5,64.4 | JP5.2 61.5,46.61 v65.41,46.61 | IC1.20 54.75,69.34 59.69,64.4 61.5,64.4 | 61.5,64.4 JP4.2
  Bottom 0.305: v65.41,82.49 v65.41,64.4 v65.41,46.61 v65.41,28.52
+3V3  (via drill 0.6)
  Top 0.254: IC1.40 25.08,66.13 24.92,66.3 C3.1
  Top 0.305: C5.1 19.37,79.32 19.37,78.05 19.68,77.73 IC2.8 v23.18,77.73 | 35.56,68.52 36.35,67.73 IC1.18 38.57,67.73 38.73,67.57 C2.1 | 33.35,63.11 IC1.8 C1.1 | IC1.40 27.15,66.13 27.94,65.35 | 72.39,64.71 R26.2 72.07,64.71 v71.12,65.66 | 72.39,66.62 R28.2 72.07,66.62 v71.12,65.66 | 72.71,75.83 72.81,75.83 R20.2 72.07,75.51 v71.12,76.46 72.07,77.41 R22.2 | v71.12,29.79 72.07,30.74 R29.2 | v71.12,29.79 72.07,28.84 R27.2 | v71.12,39.95 72.07,40.9 R23.2 | R21.2 72.07,39 v71.12,39.95 | v71.12,39.95 v71.12,65.66 | v53.02,33.28 67.63,33.28 v71.12,29.79 | IC1.30 30.15,70.75 v27.94,70.75 | R3.2 21.91,69.79 v21.91,71.06 | 28.68,86.59 C10.1 28.57,86.62 | 28.57,86.62 28.57,86.59 | 28.57,86.62 v26.67,86.62 IC5.8 19.37,86.62 19.05,86.94 19.05,88.21 C12.1 R17.2
  Top 0.406: v35.56,63.12 35.55,63.11 33.35,63.11 | v41.91,39.63 C7.1 43.5,35.48 IC3.2
  Bottom 0.305: v71.12,65.66 v71.12,76.46 | v41.91,39.63 48.26,33.28 v53.02,33.28 | v71.12,29.79 v71.12,39.95 | v21.91,71.06 27.62,71.06 v27.94,70.75 27.94,77.73 | 27.94,77.73 27.94,81.82 27.95,85.38 v26.68,86.62 v26.67,86.62 | 27.94,77.73 v23.18,77.73
  Bottom 0.406: v41.91,39.63 41.91,56.77 v35.56,63.12
  pour Top (isolate 0.406): 27.3,71.38 36.2,71.38 36.2,62.49 27.3,62.49
+5V  (via drill 0.6)
  Top 0.305: 78.42,28.52 IC7.3 | 78.42,28.52 77.15,27.25 C14.1 | 76.2,62.81 78.42,62.81 | 78.42,62.81 IC6.3 | 74.61,63.12 C13.1 76.2,62.81 | 78.42,62.81 R24.2 | v79.38,28.52 78.42,28.52 | v76.2,63.76 76.2,62.81 | JP6.1 61.57,31.08 61.59,31.06 | 61.5,49.16 JP5.1 | 61.5,66.94 JP4.1 | 61.5,85.03 JP3.1 | 29.21,35.82 29.21,26.33 27.9,25.02 4.76,25.02 1.59,28.2 1.59,68.52 7.3,74.24 7.3,82.33 X3.4
  Top 0.406: C6.1 29.21,35.82 31.75,35.82 | 31.75,35.82 38.1,35.82 | 38.1,35.82 v38.1,34.55 | 61.59,31.06 v67.31,31.06 | v67.31,49.16 61.5,49.16 | v67.31,66.94 61.5,66.94 | v67.31,85.03 61.5,85.03 | 31.75,35.82 CF1.3 | 41.19,35.82 IC3.3 | 41.19,35.82 41.27,35.82 | 38.1,35.82 41.19,35.82
  Bottom 0.305: JP6.1 61.5,31.06
  Bottom 0.406: 67.31,63.76 v76.2,63.76 | 67.31,63.76 v67.31,66.94 v67.31,85.03 | v38.1,34.55 41.55,31.08 JP6.1 | v79.38,28.52 69.85,28.52 v67.31,31.06 v67.31,49.16 67.31,63.76
BLUE
  Top 0.305: X4.3 12.62,33.52 17.46,38.37 17.46,40.27 | 17.46,40.27 R15.2 | 17.46,40.27 19.05,40.27 R14.2
BLUE0
  Top 0.305: IC1.43 24.74,63.73 24.13,63.12 24.13,51.06 17.46,44.39 R15.1
BLUE1
  Top 0.305: IC1.44 24.89,62.94 24.77,62.81 24.77,50.11 19.05,44.39 R14.1
COMP0
  Top 0.305: R22.1 75.22,77.41 77.15,75.48 IC6.13 77.15,72.02 76.52,71.38 39.69,71.38 38.42,72.65 35.72,72.65 35.72,72.63 IC1.23
COMP1
  Top 0.305: R20.1 75.88,75.51 IC6.14 75.88,72.02 40.32,72.02 38.1,74.24 35.59,74.24 34.95,73.6 IC1.24
COMP2
  Top 0.305: R28.1 75.88,66.62 IC6.1 75.88,70.11 38.42,70.11 38.39,70.13 IC1.21
COMP3
  Top 0.305: R26.1 75.25,64.71 77.15,66.62 IC6.2 77.15,70.11 76.52,70.75 39.05,70.75 38.86,70.94 IC1.22
COMP4
  Top 0.305: R23.1 75.25,40.9 77.15,39 IC7.13 77.15,35.82 76.52,35.19 73.04,35.19 69.53,38.69 69.53,51.06 66.99,53.6 53.98,53.6 43.04,64.53 IC1.14
COMP5
  Top 0.305: R21.1 75.88,39 IC7.14 75.88,35.82 73.66,35.82 70.17,39.31 70.17,51.7 67.31,54.55 54.29,54.55 43.51,65.34 IC1.15
COMP6
  Top 0.305: R29.1 75.88,30.74 IC7.1 75.88,33.91 71.75,33.91 68.26,37.41 68.26,49.79 66.36,51.7 53.34,51.7 42.1,62.94 IC1.12
COMP7
  Top 0.305: R27.1 75.22,28.84 77.15,30.77 IC7.2 77.15,33.91 76.52,34.55 72.4,34.55 68.9,38.06 68.9,50.42 66.67,52.65 53.66,52.65 42.57,63.73 IC1.13
DAC_LOAD  (via drill 0.6)
  Top 0.305: JP6.5 61.5,20.58 v66.36,20.58 | JP3.5 61.5,74.87 v66.36,74.87 | v66.36,56.77 61.5,56.77 | JP5.5 61.5,39 v66.36,39 | IC1.16 44.3,66.13 53.66,56.77 61.5,56.77 | 61.5,56.77 JP4.5
  Bottom 0.305: v66.36,74.87 v66.36,56.77 v66.36,39 v66.36,20.58
DTR
  Top 0.254: IC4.2 18.82,66.85 21.27,64.4 C4.1
GND  (via drill 0.6)
  Top 0.254: 14.91,67.25 13.6,67.25 12.96,66.62 IC4.18 12.96,62.54 13.34,62.17 C9.2 | 17.52,67.25 18.16,66.6 IC4.26 | 17.52,67.25 IC4.25 | 14.91,67.25 IC4.21 | 16.19,67.25 14.91,67.25 | 16.19,67.25 17.52,67.25 | v16.19,66.3 16.19,67.25 | T1.2 | 19.37,59.63 R2.1 | v20.95,66.3 C3.2
  Top 0.305: 18.41,76.46 IC2.7 | IC2.4 17.46,73.92 18.41,74.87 18.41,75.19 | 17.46,77.73 IC2.1 | 18.41,76.46 18.41,76.78 17.46,77.73 | 18.41,76.46 IC2.2 | 18.41,75.19 IC2.3 | C5.2 17.46,79.32 17.46,77.73 | 18.41,76.46 v18.41,75.83 18.41,75.19 | v27.94,66.94 IC1.39 | IC1.27 32.55,70.91 v32.38,70.75 | v35.56,66.94 IC1.17 | IC1.6 v31.75,63.12 31.3,63.12 30.95,62.77 IC1.5 | v42.86,67.57 C2.2 | T1.2 19.37,59.63 v19.37,60.9 | v78.42,75.51 IC6.12 | v71.12,27.25 C14.2 | v78.42,39.63 IC7.12 | v78.42,52.33 R25.1 | C13.2 72.71,62.7 v72.71,61.54 | S1.P$2 v21.27,22.8 S1.P$4 | X2.4 9.94,54.23 11.11,54.23 C8.2 | 18.1,85.35 IC5.2 | v18.1,84.72 18.1,85.35 | 18.1,85.35 IC5.7 | 17.14,86.62 IC5.1 | v18.1,84.72 18.1,85.67 17.14,86.62 | 18.1,84.08 IC5.3 | v18.1,84.72 18.1,84.08 | v48.58,76.14 LED1.C | v15.56,69.47 IC4.7 | v33.34,54.23 C1.2 | C12.2 17.14,88.21 17.14,86.62 | JP7.2 C11.2 33.66,84.08 33.66,82.17 R19.1 | 18.1,84.08 18.1,83.76 17.14,82.81 IC5.4
  Top 0.406: v45.72,41.53 C7.2 v34.29,41.53 CF1.2@2 | C6.2 v29.21,41.53 CF1.2@1 | IC3.1 45.76,35.82 45.72,35.82 v45.72,37.73
  Bottom 0.305: 4,57.47 X2.S1 4,67.89 5.96,67.89 | 4,57.47 X2.4 | 4,57.47 X2.S2 4,36.95 | 19.37,66.3 v16.19,66.3 16.19,67.89 | v32.38,70.75 29.53,70.75 27.94,69.16 v27.94,66.94 27.94,63.12 | 35.56,67.57 v35.56,66.94 35.56,65.03 33.66,63.12 v31.75,63.12 27.94,63.12 | 35.56,67.57 35.56,70.75 v32.38,70.75 | 35.56,67.57 v42.86,67.57 48.58,67.57 v48.58,76.14 | v29.21,41.53 v34.29,41.53 | 19.37,63.12 v19.37,60.9 | 19.37,66.3 19.37,63.12 | 19.37,66.3 v20.95,66.3 | 19.37,63.12 27.94,63.12 | JP10.2 78.42,80 v78.42,75.51 78.42,61.54 | JP11.2 85.41,62 85.41,52.33 | 85.41,44 JP9.2 | 85.41,44 85.41,52.33 | JP12.2 85.41,26 85.41,27.25 | 85.41,27.25 85.41,37.41 | v71.12,27.25 85.41,27.25 | 85.41,37.41 85.41,44 | 85.41,37.41 78.42,37.41 v78.42,39.63 | 78.42,61.54 v72.71,61.54 | 78.42,57.41 78.42,61.54 | 5.96,67.89 X3.3 | 5.96,67.89 15.56,67.89 | 15.56,67.89 16.19,67.89 | 21.27,24.39 v21.27,22.8 | 21.27,24.39 8.26,24.39 X4.6 | X4.6 X4.7 X4.8 | X4.6 8.26,28.95 X4.11 3.81,28.95 3.81,36.95 4,36.95 | 4,36.95 X4.10 | 21.27,24.39 34.59,24.39 X1.B2 X1.A2 | 16.19,67.89 19.37,67.89 v18.41,75.83 | 15.56,67.89 15.56,68.2 v15.56,69.47 | v32.38,70.75 32.38,88.84 18.1,88.84 v18.1,84.72 | 32.07,54.23 v33.34,54.23 | 85.41,52.33 80.33,57.41 78.42,57.41 | 78.42,57.41 v78.42,52.33
  Bottom 0.406: v71.12,27.25 71.12,17.41 34.61,17.41 34.61,24.39 34.59,24.39 | X1.A2 34.59,41.53 v29.21,41.53 | v45.72,41.53 v45.72,37.73
  pour Bottom (isolate 0.406): 0,90.43 0,15.5 120.02,15.5 120.02,90.43
GNDINT  (via drill 0.6)
  Top 0.305: C17.2 68.17,12.18 68.17,8.27 | 73.56,8.27 IC8.12 68.17,8.27 | 73.56,8.27 73.56,7.42 R34.1 | 73.56,8.27 73.56,9.12 C15.2 | IC8.9 73.35,4.46 C16.2 | R40.1 73.56,2.55 73.56,4.04 C16.2 | C16.2 73.67,4.36 73.56,4.46 v69.44,4.46 68.17,5.73 68.17,8.27 | C18.2 85.63,12.29 85.63,11.28 v85.09,10.74 | IC9.11 JP14.2
  Bottom 0.305: 85.31,7 83.09,7 81.5,5.41 69.12,5.41 v69.44,4.46
  Bottom 0.406: v85.09,10.74 86.11,10.74 89.85,7 JP14.2
  pour Bottom (isolate 0.406): 51.75,13.91 51.75,-0.06 115.57,-0.06 115.57,13.91
GREEN
  Top 0.305: X4.2 13.51,31.24 20.64,38.37 20.64,40.27 | 20.64,40.27 R12.2 | 20.64,40.27 22.23,40.27 R10.2
GREEN0
  Top 0.305: IC1.1 27.75,51.38 20.64,44.27 R12.1
GREEN1
  Top 0.305: IC1.2 28.55,50.42 22.23,44.1 R10.1
HOR_SYNC
  Top 0.305: IC1.42 24.59,64.53 23.5,63.44 23.5,52.01 15.88,44.39 R11.2
HSYNC
  Top 0.305: X4.13 8.89,33.52 10.07,34.71 12.22,34.71 15.88,38.36 R11.1
KEYB_CLOCK
  Top 0.305: IC1.33 27.75,75.5 22.35,80.91 R7.2
KEYB_DATA
  Top 0.305: IC1.34 26.05,71.06 26.04,71.06 R6.2
N$1
  Top 0.305: IC1.28 31.75,74.24 33.34,75.83 33.34,78.95 34.02,79.64 34.97,79.64 Q1.3
N$2
  Top 0.305: IC1.29 30.95,76.72 Q1.1
N$3
  Top 0.254: 21.27,59.63 R2.2 | T1.1
  Top 0.305: C4.2 21.27,59.63 T1.1
N$4  (via drill 0.6)
  Top 0.305: T1.3 v20.32,53.92 v17.14,50.74 | v31.75,59.31 32.55,60.12 IC1.7 | S1.P$1 v21.27,27.25 S1.P$3
  Bottom 0.305: v31.75,59.31 26.35,53.92 v20.32,53.92 | v21.27,27.25 20.95,46.93 v17.14,50.74
N$5
  Top 0.254: 17.14,55.51 R4.2 | 15.24,55.51 R5.2 | IC4.4 17.52,69.79 15.93,68.2 13.59,68.2 12.31,66.93 IC4.17 12.31,59.1 C9.1
  Top 0.305: 17.14,55.51 15.24,55.51 14.34,55.51 13.34,56.51 C9.1
N$6
  Top 0.254: X2.2 8.57,60.1 8.57,61.22 8.57,61.54 9.44,62.41 11.26,62.41 11.66,62.82 IC4.16
N$7
  Top 0.254: IC4.15 11.02,63.03 8.16,63.03 6.67,61.54 6.67,60.01 X2.3
N$8  (via drill 0.6)
  Top 0.254: IC4.20 14.27,66 v13.97,66.3
  Top 0.305: X2.1 10.04,56.14 11.11,56.14 C8.1
  Bottom 0.305: 13.97,57.33 v13.97,66.3
  Bottom 0.406: X2.1 8.85,57.33 13.97,57.33 21.51,49.47 JP2.3
N$9
  Top 0.305: IC9.3 77.38,8.27 77.06,7.95 77.06,7.42 R32.1 R34.2
N$10
  Top 0.305: IC9.2 77.38,9.54 77.06,9.86 77.06,10.71 R35.1
N$11
  Top 0.305: R35.2 IC9.1 82.14,10.81 82.14,12.29 R33.1
N$12
  Top 0.406: JP2.2 32.7,46.93 31.75,45.98 CF1.1
N$13
  Top 0.305: 92.5,10.81 JP14.1 | IC9.14 92.5,10.81 | 92.5,10.81 93.45,11.76 102.46,11.76 103.41,10.81 105.44,10.81 X5.A4 105.57,10.75 105.63,10.81 110.44,10.81 X5.B4
N$14  (via drill 0.6)
  Top 0.305: R30.1 75.47,10.81 75.47,9.32 C15.1 76.42,9.22 v76.74,8.91 | v85.31,8.27 IC9.12
  Bottom 0.305: v76.74,8.91 84.68,8.91 v85.31,8.27
N$15
  Top 0.305: IC8.14 R30.2
N$16
  Top 0.305: IC8.10 R36.2
N$17
  Top 0.305: IC9.13 89.44,9.54 R31.2
N$18
  Top 0.305: R4.1 LED2.A
N$19
  Top 0.305: R5.1 LED3.A
N$20
  Top 0.254: IC4.23 16.21,62.78 17.14,61.85 LED2.C
N$21
  Top 0.254: IC4.22 15.56,62.18 15.24,61.85 LED3.C
N$22
  Top 0.305: IC8.3 64.67,8.27 63.41,9.54 JP13.2
N$23
  Top 0.305: R38.1 77.16,4.99 77.69,4.46 | R40.2 76.81,2.55 77.69,3.44 77.69,4.46 | IC9.5 80.55,5.73 79.28,4.46 77.69,4.46
N$24
  Top 0.305: IC9.6 83.72,4.46 85.63,2.55 85.63,1.71 R41.1
N$25
  Top 0.305: IC9.7 82.14,3.19 82.14,1.71 | R39.1 82.14,1.71 | 82.14,1.71 82.14,1.6 R41.2
N$26
  Top 0.305: 92.5,3.19 JP14.3 | IC9.8 92.5,3.19 | 92.5,3.19 93.45,2.24 102.46,2.24 103.41,3.19 105.44,3.19 X5.A1 105.57,3.25 105.63,3.19 110.44,3.19 X5.B1
N$27  (via drill 0.6)
  Top 0.305: C16.1 75.47,4.14 | 75.47,4.14 75.47,5.63 | 75.47,5.63 R36.1 75.47,5.73 75.47,5.63 | 75.47,4.14 v76.74,4.14 | v85.31,5.73 IC9.10
  Bottom 0.305: v76.74,4.14 83.72,4.14 v85.31,5.73
N$28
  Top 0.305: JP13.3 IC8.4
N$29
  Top 0.305: IC9.9 89.44,4.46 R37.2
N$30  (via drill 0.6)
  Top 0.305: R37.1 90.5,5.95 90.71,5.73 93.89,5.73 96.74,2.87 100.55,2.87 103.41,5.73 105.48,5.73 X5.A2 105.61,5.75 105.63,5.73 110.48,5.73 X5.B2 | R39.2 v78.96,1.6
  Bottom 0.305: v78.96,1.6 99.28,1.6 103.41,5.73 105.48,5.73 X5.A2
N$31
  Top 0.305: IC8.5 64.67,5.73 63.41,4.46 JP13.4
N$32
  Top 0.305: JP13.5 68.17,1.92 69.44,3.19 IC8.8
N$33  (via drill 0.6)
  Top 0.305: R31.1 90.5,8.05 90.71,8.27 93.89,8.27 96.74,11.13 100.55,11.13 103.41,8.27 105.48,8.27 X5.A3 105.61,8.25 105.63,8.27 110.48,8.27 X5.B3 | R33.2 v78.96,12.4
  Bottom 0.305: v78.96,12.4 99.28,12.4 103.41,8.27 105.48,8.27 X5.A3
N$34
  Top 0.305: JP11.1 88.44,59.46 80.96,66.94 IC6.5
N$35
  Bottom 0.305: 32.09,29.47 32.07,29.47
  Bottom 0.406: X1.B1 32.09,29.47 X1.A1 32.07,31.97 | 32.07,29.47 30.5,29.47 27.62,32.34 27.62,41.85 30.16,44.39 JP2.1
N$36
  Top 0.305: IC1.26 33.35,73.6 35.26,75.51 38.1,75.51 38.73,76.14 R1.2
N$37
  Top 0.305: LED1.A 44.13,76.14 JP1.1
  Top 0.406: R1.1 44.13,76.14
N$38
  Top 0.305: IC6.9 82.23,75.17 84.53,77.46 JP10.1
N$39
  Top 0.305: IC6.11 79.69,75.18 87.05,82.54 JP10.3
N$40  (via drill 0.6)
  Top 0.305: v26.04,75.67 R6.1
  Bottom 0.305: X3.2 6.03,81.57 6.03,78.97 X3.1 18.13,78.97 21.43,75.67 v26.04,75.67
N$41
  Top 0.305: JP11.3 85.9,64.54 83.5,66.94 IC6.7
N$42  (via drill 0.6)
  Top 0.305: IC5.5 JP8.1 | v23.81,87.57 23.18,88.21 R17.1
  Bottom 0.305: JP8.1 v23.81,87.57
N$43
  Top 0.305: R16.2 JP7.1
N$46
  Top 0.305: IC7.9 82.23,39 84.7,41.46 JP9.1
N$47
  Top 0.305: IC7.11 79.69,39.95 86.28,46.54 JP9.3
N$48  (via drill 0.6)
  Top 0.305: 80.96,71.06 79.69,69.79 IC6.4 79.69,56.46 | 80.96,71.06 IC6.10 | 80.96,71.06 82.23,71.06 | 82.23,71.06 83.5,72.33 IC6.8 | 82.23,71.06 IC6.6 | 82.23,34.87 83.5,36.14 IC7.8 | IC7.4 79.69,33.6 80.96,34.87 | 82.23,34.87 IC7.6 | 80.96,34.87 IC7.10 v80.96,39.63 | 80.96,34.87 82.23,34.87 | v80.96,55.19 79.69,56.46 | 78.42,56.46 R25.2 | 78.42,56.46 R24.1 | 79.69,56.46 78.42,56.46
  Bottom 0.305: v80.96,39.63 v80.96,55.19
N$49
  Top 0.305: IC7.5 80.96,30.74 88.24,23.46 JP12.1
N$50
  Top 0.305: IC7.7 83.5,30.76 85.72,28.54 JP12.3
N$65
  Top 0.305: X3.5 8.46,80.91 | 8.46,80.91 R7.1 | 8.46,80.91 X3.6
RED
  Top 0.305: X4.1 14.4,28.95 23.81,38.36 23.81,40.27 | 23.81,40.27 R9.2 | 23.81,40.27 25.4,40.27 R8.2
RED0
  Top 0.305: IC1.3 29.35,49.47 23.81,43.94 R9.1
RED1
  Top 0.305: IC1.4 30.15,48.52 25.4,43.77 R8.1
RXD
  Top 0.254: IC1.37 21.31,68.53 20.32,69.53 20.32,72.65 20,72.97 17.18,72.97 16.86,72.65 IC4.5
SCL
  Top 0.305: IC1.35 25.08,70.13 24.61,70.61 24.61,74.4 23.81,75.19 IC2.6
SCL_2
  Top 0.305: 31.75,86.62 31.75,84.18 C11.1 31.75,84.08 | IC1.31 29.35,81.05 30.48,82.17 | 30.48,85.35 30.48,86.62 C10.2 R16.1 | 31.75,84.08 R18.2 | 30.48,82.17 30.48,85.35 | IC5.6 22.23,84.08 23.5,85.35 30.48,85.35 | 31.75,82.17 R19.2 | 31.75,82.17 31.75,84.08 | 30.48,82.17 31.75,82.17
SDA
  Top 0.305: 23.81,69.79 24.45,69.79 24.91,69.34 IC1.36 | 23.81,69.79 23.81,73.6 23.5,73.92 IC2.5 | R3.1 23.81,69.79
SDA_2
  Top 0.305: IC1.32 28.55,82.81 | 28.55,82.81 JP8.2 | 28.55,82.81 28.55,84.08 R18.1
SPI_D0
  Top 0.305: JP3.4 59.74,77.46 57.47,74.87 35.43,74.87 34.15,73.59 IC1.25
SPI_D1
  Top 0.305: IC1.19 43.48,68.53 54.29,57.73 57.78,57.73 59.37,59.31 61.5,59.31 JP4.4
SPI_D2
  Top 0.305: IC1.10 34.95,58.97 54.29,39.63 57.78,39.63 59.62,41.46 JP5.4
SPI_D3
  Top 0.305: JP6.4 59.71,23.46 57.78,21.53 54.29,21.53 51.12,24.71 51.12,41.53 34.15,58.5 IC1.9
SPI_SCK  (via drill 0.6)
  Top 0.305: JP5.3 61.5,44.08 v64.45,44.08 | JP3.3 61.5,79.95 v64.45,79.95 | JP4.3 61.5,62.17 v64.45,62.17 | JP6.3 61.5,25.98 v64.45,25.98 | IC1.11 35.75,59.31 44.32,50.74 v45.09,50.74
  Bottom 0.305: v64.45,44.08 64.45,45.34 | v64.45,79.95 v64.45,62.17 64.45,50.74 | v64.45,44.08 64.45,50.74 | v64.45,25.98 v64.45,44.08 | 64.45,50.74 v45.09,50.74
TXD
  Top 0.254: IC4.1 19.46,68.86 20.59,67.73 IC1.38
VCCINT  (via drill 0.6)
  Top 0.305: IC8.1 64.67,10.81 63.41,12.08 JP13.1 | IC8.13 69.75,9.54 69.44,9.86 69.44,12.18 C17.1 v71.03,12.4 | v69.44,7 IC8.11 | R38.2 78.96,5.73 78.96,7 | 78.96,7 78.96,7.21 R32.2 | R32.2 78.86,7.1 78.96,7 | R32.2 79.18,7 v80.23,7 IC9.4 83.46,7 83.72,7.26 83.72,12.29 C18.1
  Bottom 0.305: C17.1 63.72,12.4 63.41,12.08 JP13.1 | C17.1 70.17,12.4 v71.03,12.4 | v80.23,7 v69.44,7 69.44,12.4 C17.1
VERT_SYNC
  Top 0.305: IC1.41 24.43,65.34 22.86,63.76 22.86,52.97 14.29,44.39 R13.2
VSYNC
  Top 0.305: X4.14 8.89,35.81 10.01,36.93 12.86,36.93 14.29,38.36 R13.1

### Text on the board
Top: ADC | GND | LED | GND | USB | 5V | EXT. | Open rTMS project | Version 0.9 | Tobias Schaefer | 8/14/2010 | RESET | +5V | GND